# EAGLE design OB1_sensor_manufactured (EAGLE 9.7.0)

## Sheet 1 of 2: Sensors
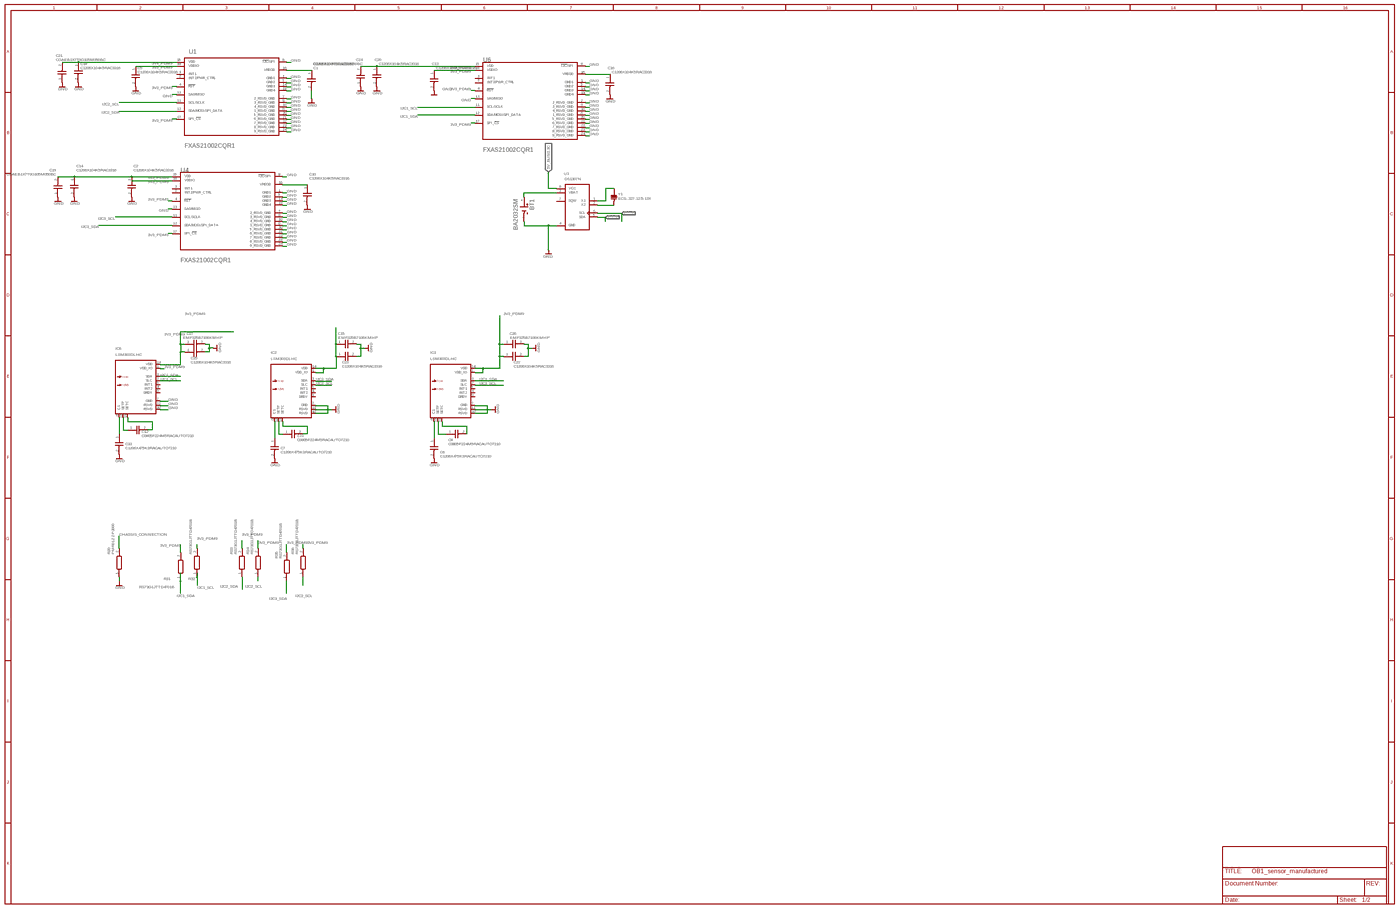
[diagram p0: schematic, sheet 1, overview]
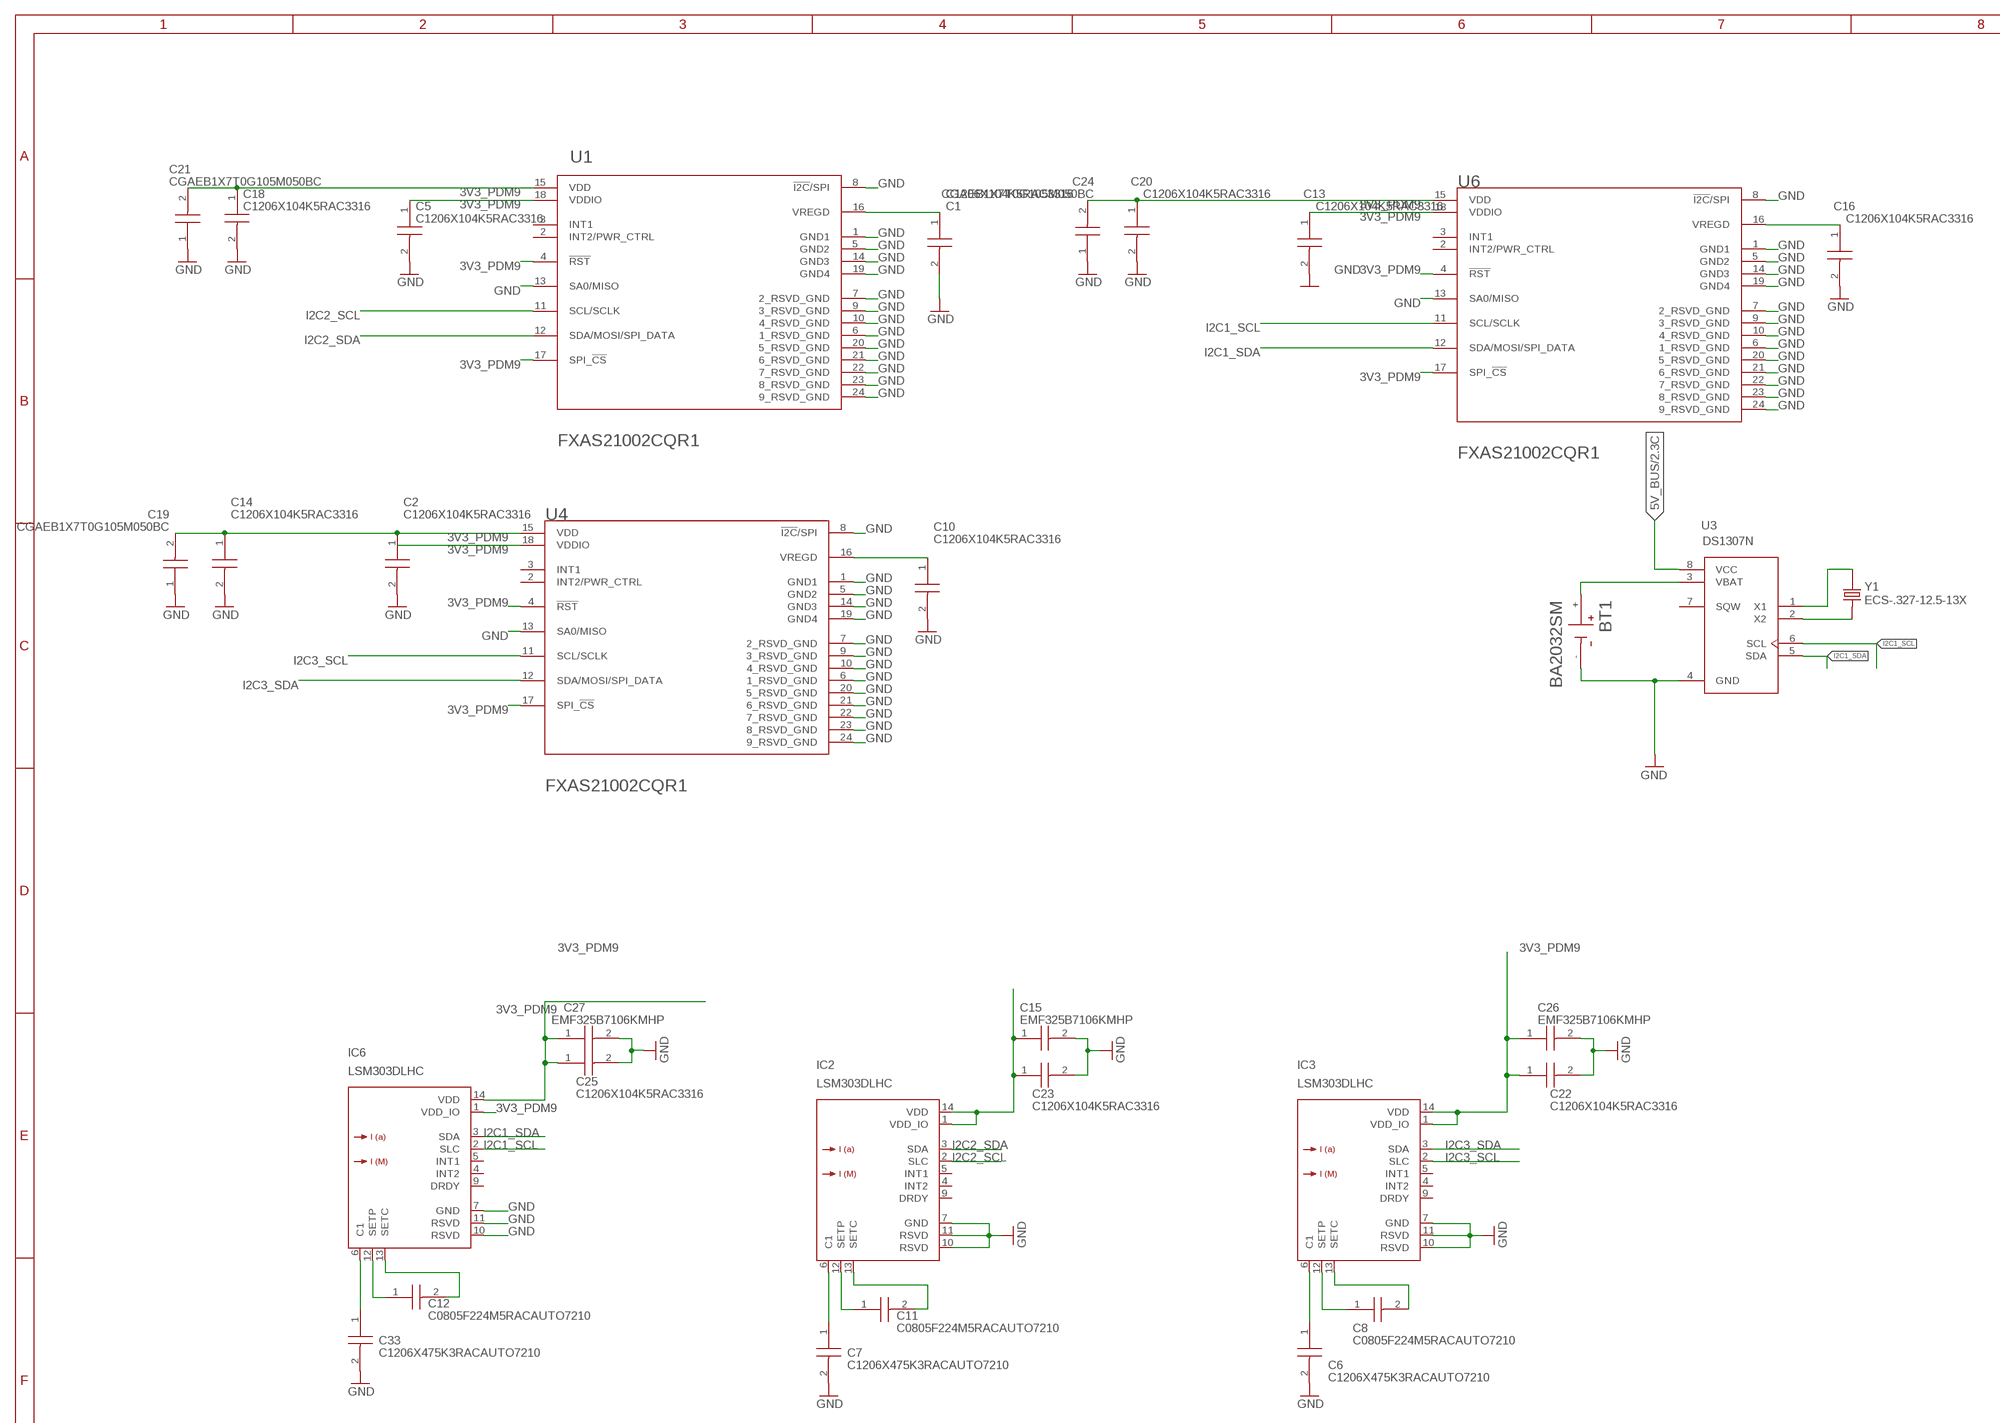
[diagram p1: schematic, sheet 1, part 1 of 4]
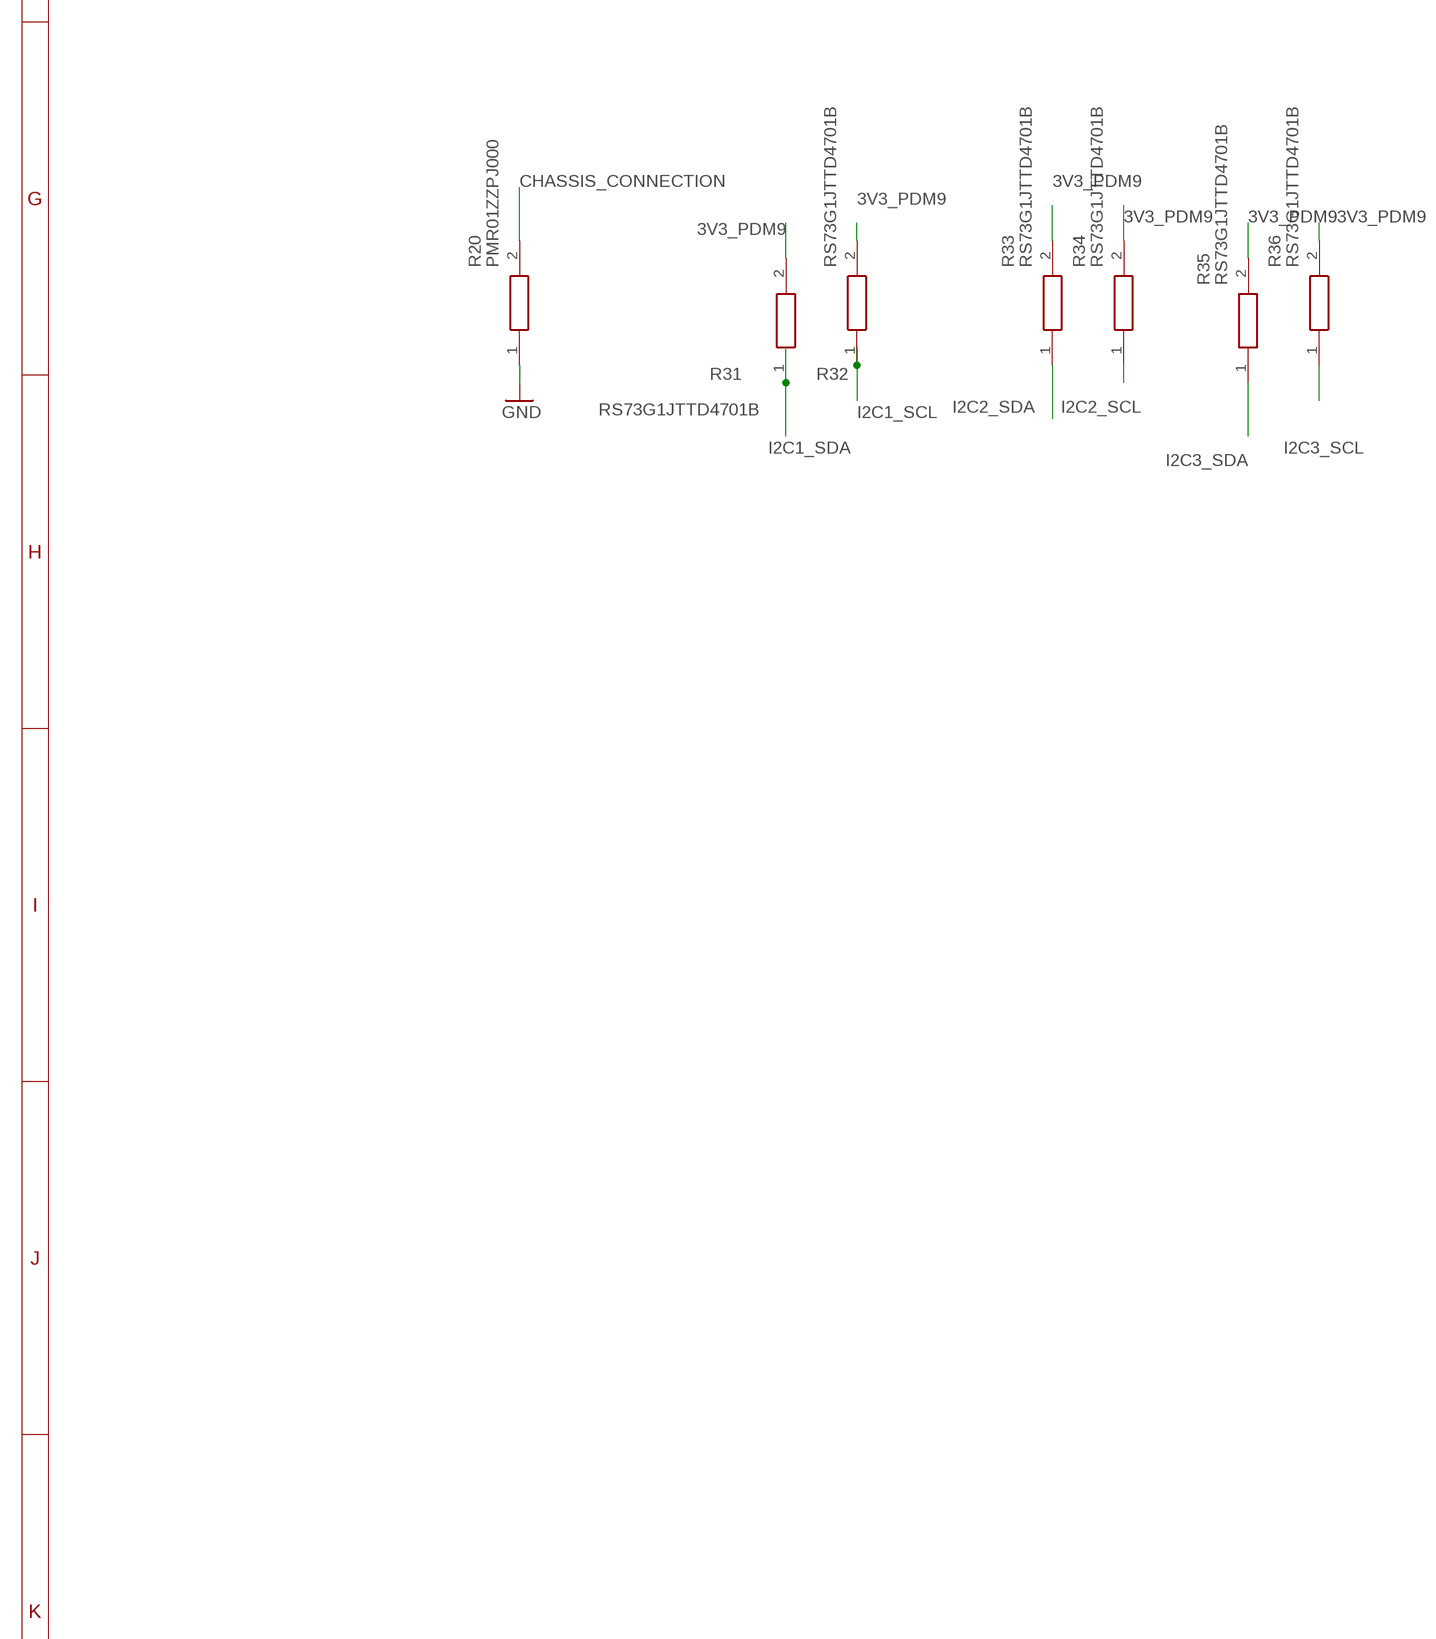
[diagram p2: schematic, sheet 1, part 2 of 4]
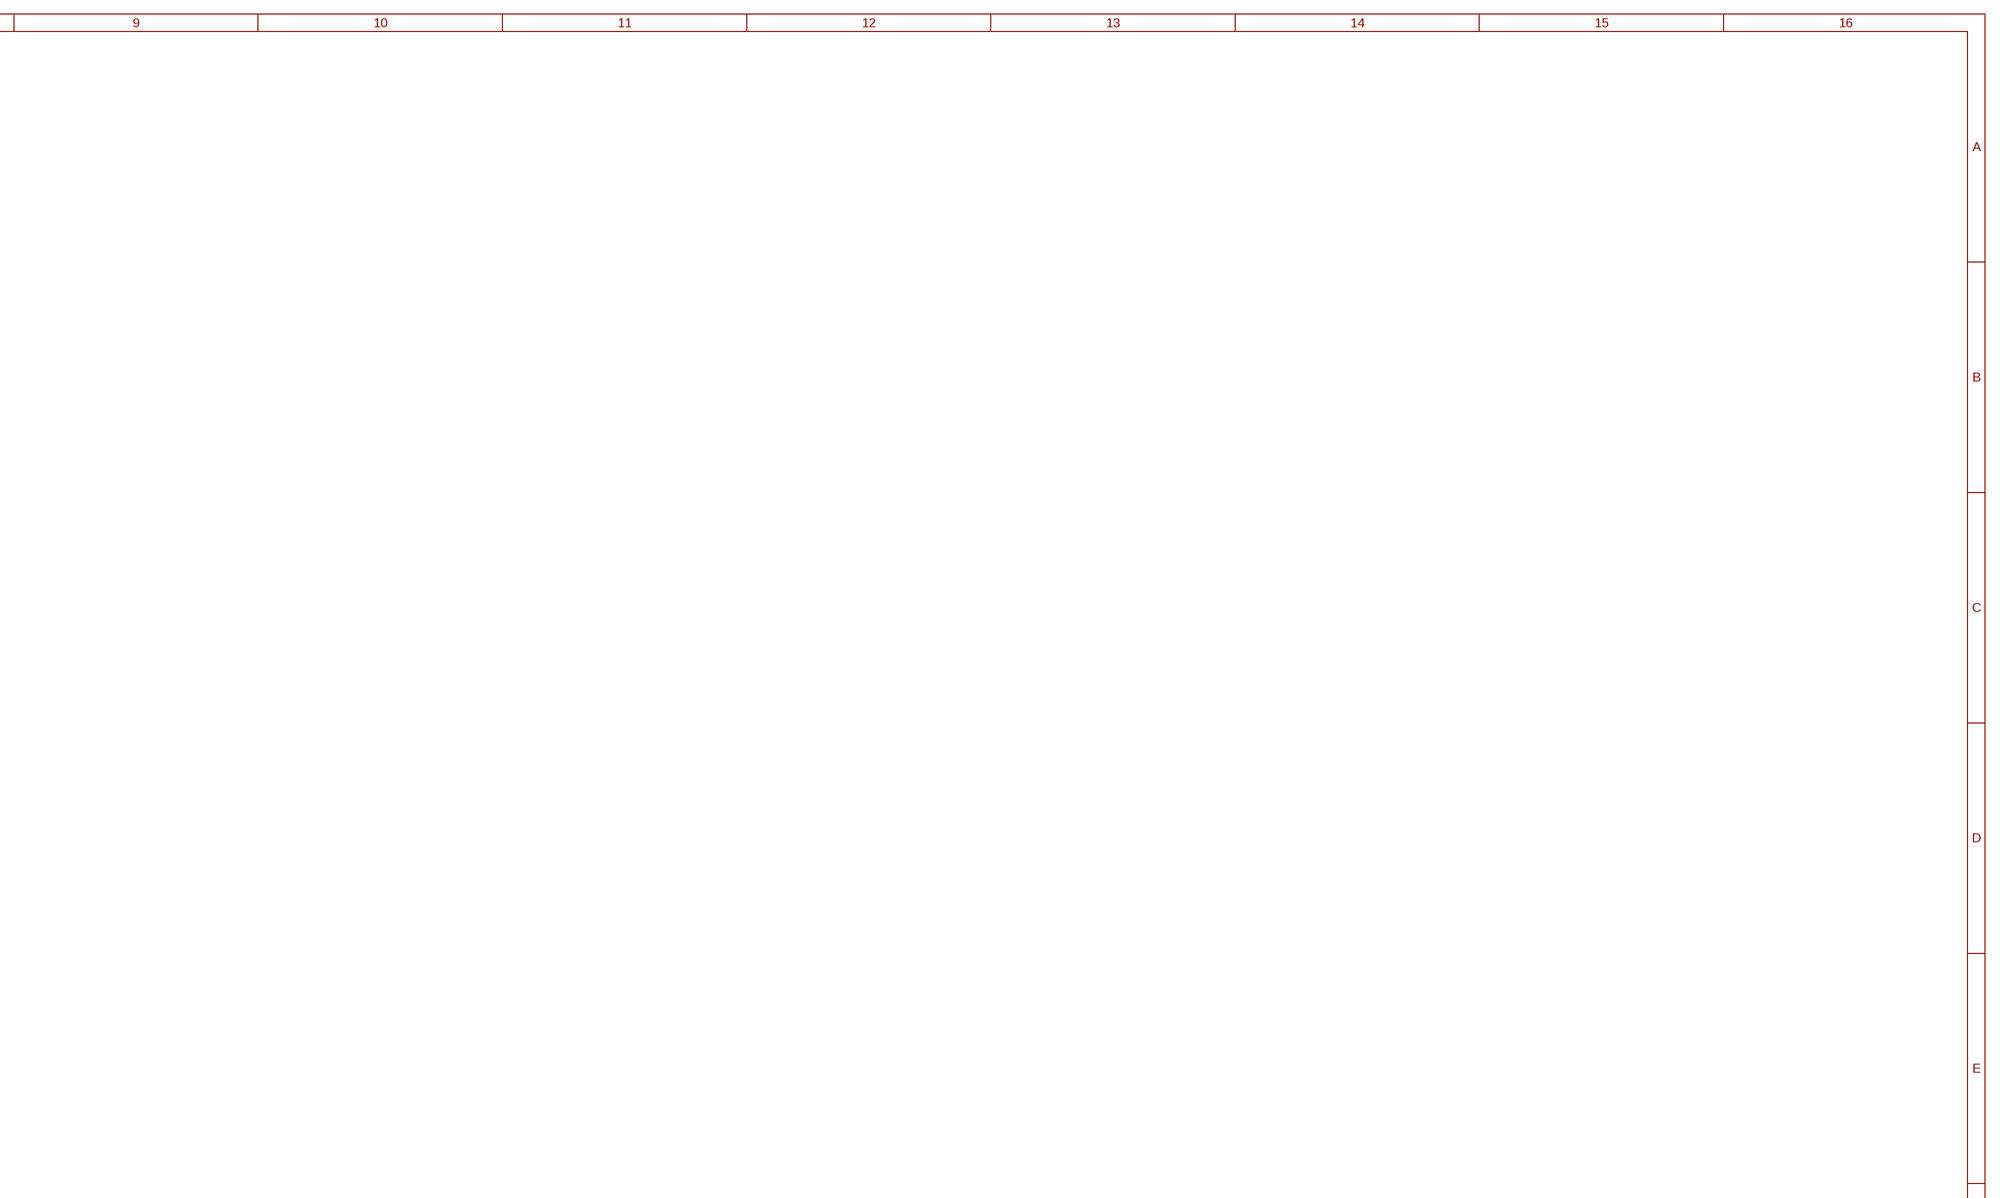
[diagram p3: schematic, sheet 1, part 3 of 4]
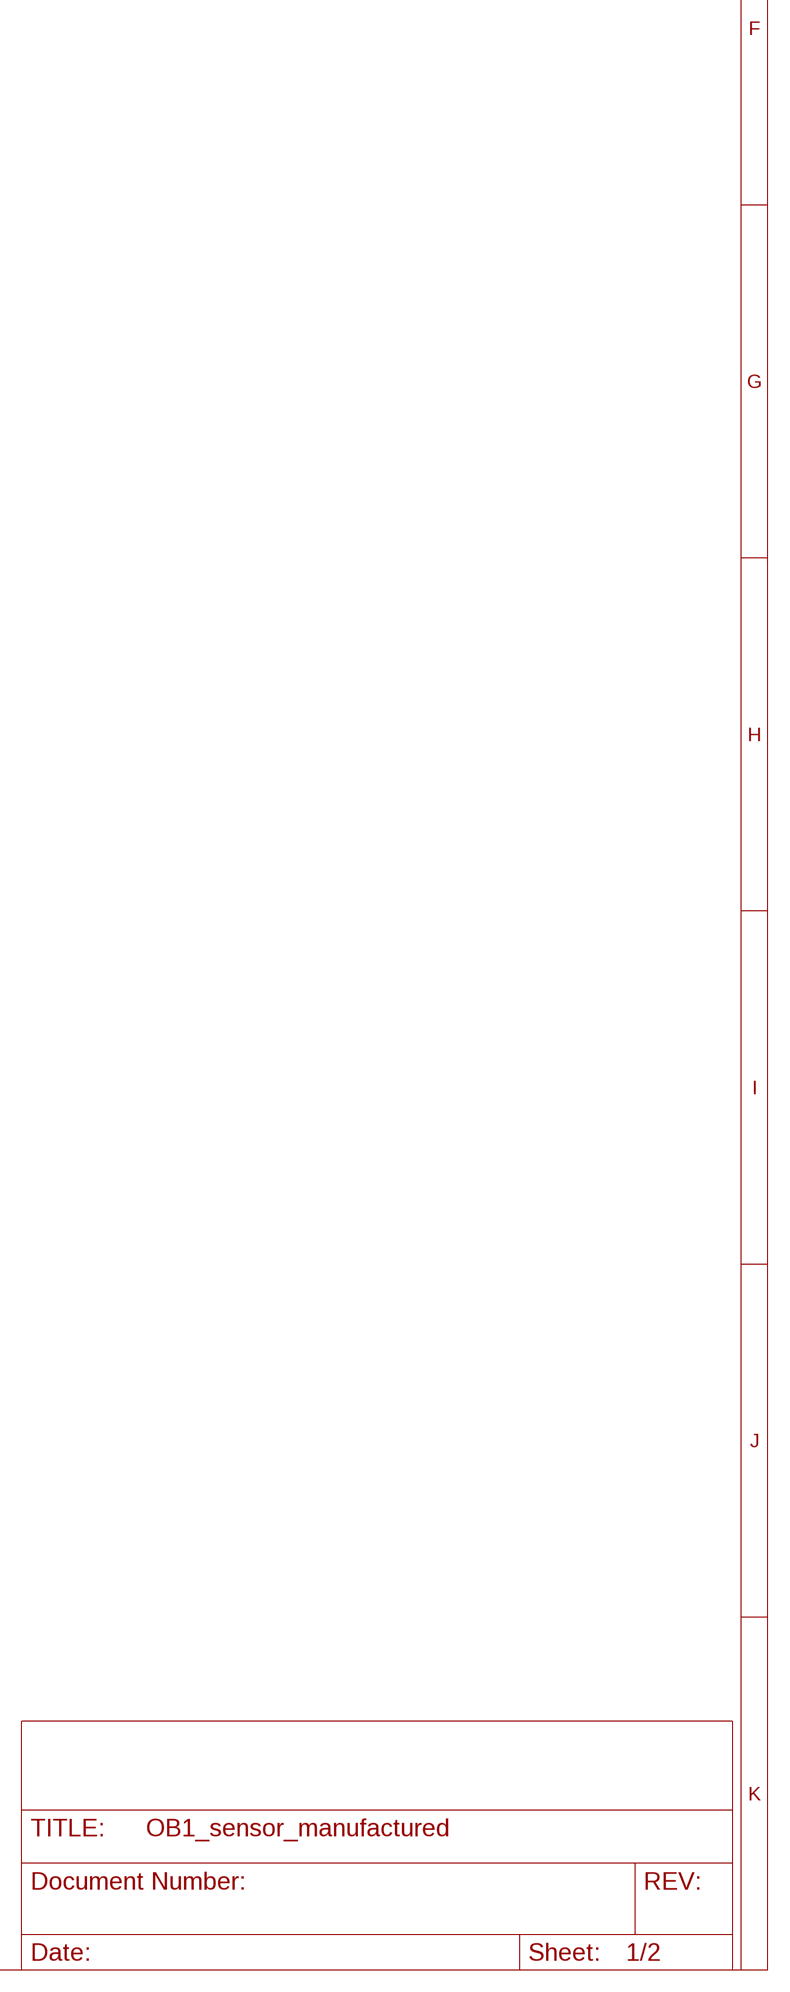
[diagram p4: schematic, sheet 1, part 4 of 4]

### Parts
BT1  BA2032SM  [BAT_BA2032SM]
C1  C1206X104K5RAC3316  [CAPC3316X98N]
C2  C1206X104K5RAC3316  [CAPC3316X98N]
C5  C1206X104K5RAC3316  [CAPC3316X98N]
C6  C1206X475K3RACAUTO7210  [CAPC3316X195N]
C7  C1206X475K3RACAUTO7210  [CAPC3316X195N]
C8  C0805F224M5RACAUTO7210  [CAPC2012X140N]
C10  C1206X104K5RAC3316  [CAPC3316X98N]
C11  C0805F224M5RACAUTO7210  [CAPC2012X140N]
C12  C0805F224M5RACAUTO7210  [CAPC2012X140N]
C13  C1206X104K5RAC3316  [CAPC3316X98N]
C14  C1206X104K5RAC3316  [CAPC3316X98N]
C15  EMF325B7106KMHP  [CAPC3225X270N]
C16  C1206X104K5RAC3316  [CAPC3316X98N]
C18  C1206X104K5RAC3316  [CAPC3316X98N]
C19  CGAEB1X7T0G105M050BC  [CAPC0611X68N]
C20  C1206X104K5RAC3316  [CAPC3316X98N]
C21  CGAEB1X7T0G105M050BC  [CAPC0611X68N]
C22  C1206X104K5RAC3316  [CAPC3316X98N]
C23  C1206X104K5RAC3316  [CAPC3316X98N]
C24  CGAEB1X7T0G105M050BC  [CAPC0611X68N]
C25  C1206X104K5RAC3316  [CAPC3316X98N]
C26  EMF325B7106KMHP  [CAPC3225X270N]
C27  EMF325B7106KMHP  [CAPC3225X270N]
C33  C1206X475K3RACAUTO7210  [CAPC3316X195N]
IC2  LSM303DLHC  [LGA-14]
IC3  LSM303DLHC  [LGA-14]
IC6  LSM303DLHC  [LGA-14]
R20  PMR01ZZPJ000  [RESC1005X35N]
R31  RS73G1JTTD4701B  [RESC1608X55N]
R32  RS73G1JTTD4701B  [RESC1608X55N]
R33  RS73G1JTTD4701B  [RESC1608X55N]
R34  RS73G1JTTD4701B  [RESC1608X55N]
R35  RS73G1JTTD4701B  [RESC1608X55N]
R36  RS73G1JTTD4701B  [RESC1608X55N]
U1  NXP_FXAS21002CQR1_EDITEDNXP_FXAS21002CQR1_0_0  [NXP_FXAS21002CQR1_0_EDITED]
U3  DS1307N  [DIP762W47P254L991H457Q8]
U4  NXP_FXAS21002CQR1_EDITEDNXP_FXAS21002CQR1_0_0  [NXP_FXAS21002CQR1_0_EDITED]
U6  NXP_FXAS21002CQR1_EDITEDNXP_FXAS21002CQR1_0_0  [NXP_FXAS21002CQR1_0_EDITED]
Y1  ECS-.327-12.5-13X  [XTAL_ECS-.327-12.5-13X]

### Nets
3V3_PDM9: C2.1 C5.1 C13.1 C14.1 C15.1 C18.1 C19.2 C20.1 C21.2 C22.1 C23.1 C24.2 C25.1 C26.1 C27.1 IC2.1(VDD_IO) IC2.14(VDD) IC3.1(VDD_IO) IC3.14(VDD) IC6.1(VDD_IO) IC6.14(VDD) R31.2 R32.2 R33.2 R34.2 R35.2 R36.2 U1.4(!RST!) U1.15(VDD) U1.17(SPI_!CS!) U1.18(VDDIO) U4.4(!RST!) U4.15(VDD) U4.17(SPI_!CS!) U4.18(VDDIO) U6.4(!RST!) U6.15(VDD) U6.17(SPI_!CS!) U6.18(VDDIO) ; also sheet 2
5V_BUS: U3.8(VCC) ; also sheet 2
CHASSIS_CONNECTION: R20.2
GND: BT1.- C1.2 C2.2 C5.2 C6.2 C7.2 C10.2 C13.2 C14.2 C15.2 C16.2 C18.2 C19.1 C20.2 C21.1 C22.2 C23.2 C24.1 C25.2 C26.2 C27.2 C33.2 IC2.7(GND) IC2.10(RSVD) IC2.11(RSVD) IC3.7(GND) IC3.10(RSVD) IC3.11(RSVD) IC6.7(GND) IC6.10(RSVD) IC6.11(RSVD) R20.1 U1.1(GND1) U1.5(GND2) U1.6(1_RSVD_GND) U1.7(2_RSVD_GND) U1.8(!I2C!/SPI) U1.9(3_RSVD_GND) U1.10(4_RSVD_GND) U1.13(SA0/MISO) U1.14(GND3) U1.19(GND4) U1.20(5_RSVD_GND) U1.21(6_RSVD_GND) U1.22(7_RSVD_GND) U1.23(8_RSVD_GND) U1.24(9_RSVD_GND) U3.4(GND) U4.1(GND1) U4.5(GND2) U4.6(1_RSVD_GND) U4.7(2_RSVD_GND) U4.8(!I2C!/SPI) U4.9(3_RSVD_GND) U4.10(4_RSVD_GND) U4.13(SA0/MISO) U4.14(GND3) U4.19(GND4) U4.20(5_RSVD_GND) U4.21(6_RSVD_GND) U4.22(7_RSVD_GND) U4.23(8_RSVD_GND) U4.24(9_RSVD_GND) U6.1(GND1) U6.5(GND2) U6.6(1_RSVD_GND) U6.7(2_RSVD_GND) U6.8(!I2C!/SPI) U6.9(3_RSVD_GND) U6.10(4_RSVD_GND) U6.13(SA0/MISO) U6.14(GND3) U6.19(GND4) U6.20(5_RSVD_GND) U6.21(6_RSVD_GND) U6.22(7_RSVD_GND) U6.23(8_RSVD_GND) U6.24(9_RSVD_GND) ; also sheet 2
I2C1_SCL: IC6.2(SLC) R32.1 U3.6(SCL) U6.11(SCL/SCLK) ; also sheet 2
I2C1_SDA: IC6.3(SDA) R31.1 U3.5(SDA) U6.12(SDA/MOSI/SPI_DATA) ; also sheet 2
I2C2_SCL: IC2.2(SLC) R34.1 U1.11(SCL/SCLK) ; also sheet 2
I2C2_SDA: IC2.3(SDA) R33.1 U1.12(SDA/MOSI/SPI_DATA) ; also sheet 2
I2C3_SCL: IC3.2(SLC) R36.1 U4.11(SCL/SCLK) ; also sheet 2
I2C3_SDA: IC3.3(SDA) R35.1 U4.12(SDA/MOSI/SPI_DATA) ; also sheet 2
N$8: C6.1 IC3.6(C1)
N$9: C8.1 IC3.12(SETP)
N$10: C8.2 IC3.13(SETC)
N$11: C11.1 IC2.12(SETP)
N$12: C11.2 IC2.13(SETC)
N$13: C7.1 IC2.6(C1)
N$14: C12.1 IC6.12(SETP)
N$15: C12.2 IC6.13(SETC)
N$16: C33.1 IC6.6(C1)
N$30: U3.2(X2) Y1.2
N$41: U3.1(X1) Y1.1
N$44: BT1.+ U3.3(VBAT)
N$67: C10.1 U4.16(VREGD)
N$71: C1.1 U1.16(VREGD)
N$72: C16.1 U6.16(VREGD)
Unconnected: IC2.4(INT2) IC2.5(INT1) IC2.9(DRDY) IC3.4(INT2) IC3.5(INT1) IC3.9(DRDY) IC6.4(INT2) IC6.5(INT1) IC6.9(DRDY) U1.2(INT2/PWR_CTRL) U1.3(INT1) U3.7(SQW) U4.2(INT2/PWR_CTRL) U4.3(INT1) U6.2(INT2/PWR_CTRL) U6.3(INT1)

## Sheet 2 of 2
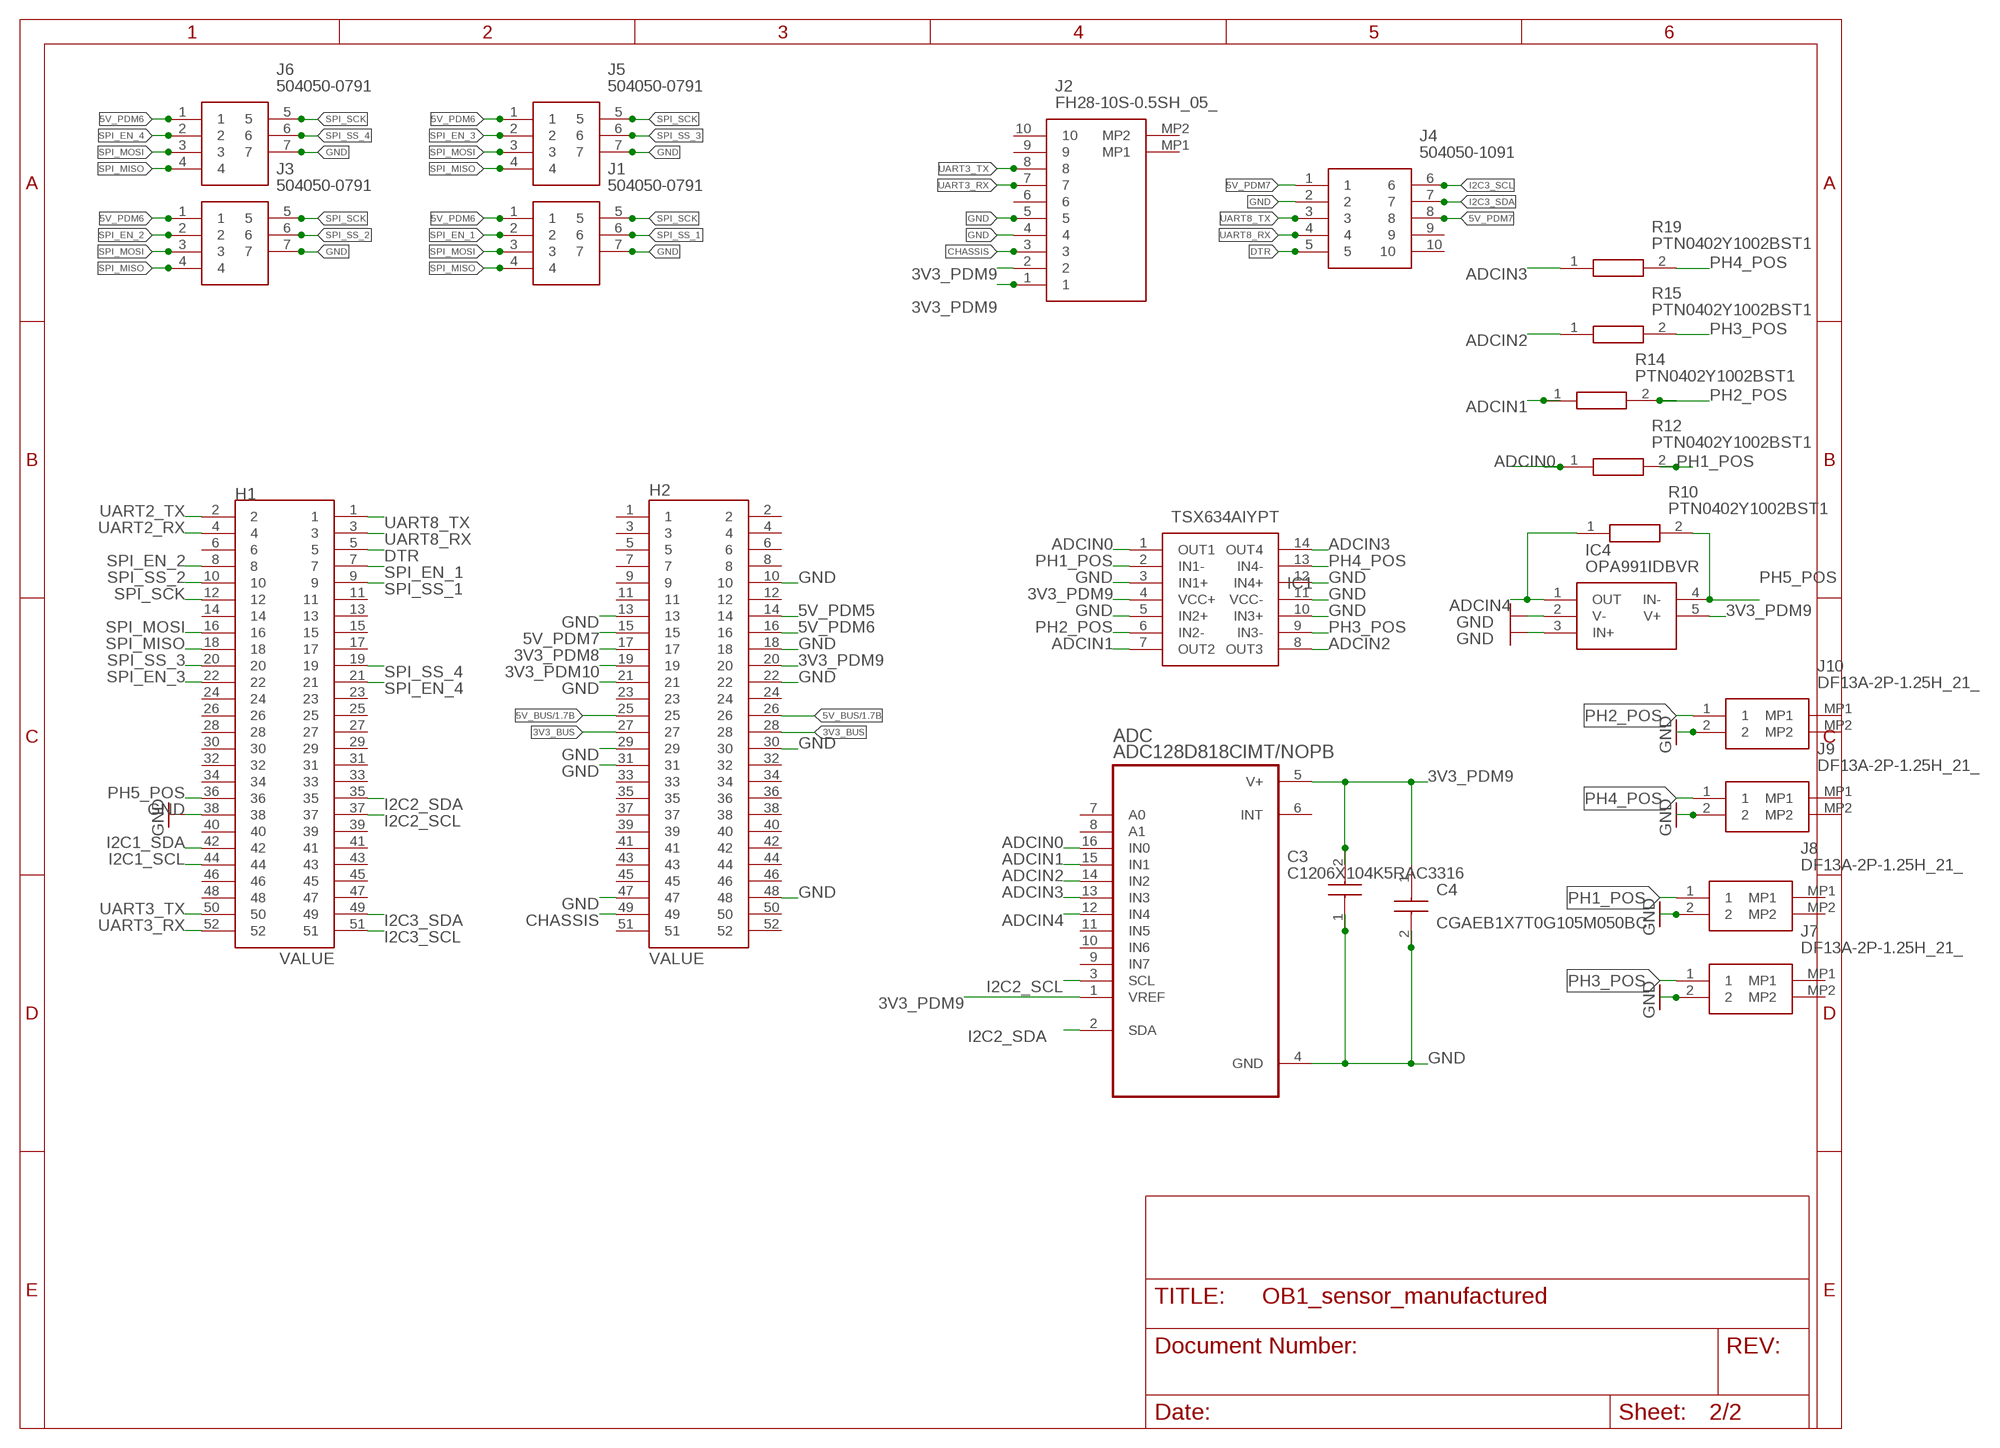
[diagram p5: schematic, sheet 2]

### Parts
ADC  ADC128D818CIMT/NOPB  [SOP65P640X120-16N]
C3  C1206X104K5RAC3316  [CAPC3316X98N]
C4  CGAEB1X7T0G105M050BC  [CAPC0611X68N]
H1  ESQ-126-39-G-D  [SAMTEC_ESQ-126-39-G-D]
H2  ESQ-126-39-G-D  [SAMTEC_ESQ-126-39-G-D]
IC1  TSX634AIYPT  [SOP65P640X120-14N]
IC4  OPA991IDBVR  [SOT95P280X145-5N]
J1  504050-0791  [504050-0791]
J2  FH28-10S-0.5SH_05_  [FH2810S05SH05]
J3  504050-0791  [504050-0791]
J4  504050-1091  [504050-1091]
J5  504050-0791  [504050-0791]
J6  504050-0791  [504050-0791]
J7  DF13A-2P-1.25H_21_  [DF13A2P125H21]
J8  DF13A-2P-1.25H_21_  [DF13A2P125H21]
J9  DF13A-2P-1.25H_21_  [DF13A2P125H21]
J10  DF13A-2P-1.25H_21_  [DF13A2P125H21]
R10  PTN0402Y1002BST1  [RESC1106X84N]
R12  PTN0402Y1002BST1  [RESC1106X84N]
R14  PTN0402Y1002BST1  [RESC1106X84N]
R15  PTN0402Y1002BST1  [RESC1106X84N]
R19  PTN0402Y1002BST1  [RESC1106X84N]

### Nets
3V3_BUS: H2.27 H2.28
3V3_PDM8: H2.17
3V3_PDM9: ADC.1(VREF) ADC.5(V+) C3.2 C4.1 H2.20 IC1.4(VCC+) IC4.5(V+) J2.1 J2.2 ; also sheet 1
3V3_PDM10: H2.19
5V_BUS: H2.25 H2.26 ; also sheet 1
5V_PDM5: H2.14
5V_PDM6: H2.16 J1.1 J3.1 J5.1 J6.1
5V_PDM7: H2.15 J4.1 J4.8
ADCIN0: ADC.16(IN0) IC1.1(OUT1) R12.1
ADCIN1: ADC.15(IN1) IC1.7(OUT2) R14.1
ADCIN2: ADC.14(IN2) IC1.8(OUT3) R15.1
ADCIN3: ADC.13(IN3) IC1.14(OUT4) R19.1
ADCIN4: ADC.12(IN4) IC4.1(OUT) R10.1
CHASSIS: H2.49 J2.3
DTR: H1.5 J4.5
GND: ADC.4(GND) C3.1 C4.2 H1.38 H2.10 H2.13 H2.18 H2.21 H2.22 H2.29 H2.30 H2.31 H2.47 H2.48 IC1.3(IN1+) IC1.5(IN2+) IC1.10(IN3+) IC1.11(VCC-) IC1.12(IN4+) IC4.2(V-) IC4.3(IN+) J1.7 J2.4 J2.5 J3.7 J4.2 J5.7 J6.7 J7.2 J8.2 J9.2 J10.2 ; also sheet 1
I2C1_SCL: H1.44 ; also sheet 1
I2C1_SDA: H1.42 ; also sheet 1
I2C2_SCL: ADC.3(SCL) H1.37 ; also sheet 1
I2C2_SDA: ADC.2(SDA) H1.35 ; also sheet 1
I2C3_SCL: H1.51 J4.6 ; also sheet 1
I2C3_SDA: H1.49 J4.7 ; also sheet 1
PH1_POS: IC1.2(IN1-) J8.1 R12.2
PH2_POS: IC1.6(IN2-) J10.1 R14.2
PH3_POS: IC1.9(IN3-) J7.1 R15.2
PH4_POS: IC1.13(IN4-) J9.1 R19.2
PH5_POS: H1.36 IC4.4(IN-) R10.2
SPI_EN_1: H1.7 J1.2
SPI_EN_2: H1.8 J3.2
SPI_EN_3: H1.22 J5.2
SPI_EN_4: H1.21 J6.2
SPI_MISO: H1.18 J1.4 J3.4 J5.4 J6.4
SPI_MOSI: H1.16 J1.3 J3.3 J5.3 J6.3
SPI_SCK: H1.12 J1.5 J3.5 J5.5 J6.5
SPI_SS_1: H1.9 J1.6
SPI_SS_2: H1.10 J3.6
SPI_SS_3: H1.20 J5.6
SPI_SS_4: H1.19 J6.6
UART2_RX: H1.4
UART2_TX: H1.2
UART3_RX: H1.52 J2.7
UART3_TX: H1.50 J2.8
UART8_RX: H1.3 J4.4
UART8_TX: H1.1 J4.3
Unconnected: ADC.6(INT) ADC.7(A0) ADC.8(A1) ADC.9(IN7) ADC.10(IN6) ADC.11(IN5) H1.6 H1.11 H1.13 H1.14 H1.15 H1.17 H1.23 H1.24 H1.25 H1.26 H1.27 H1.28 H1.29 H1.30 H1.31 H1.32 H1.33 H1.34 H1.39 H1.40 H1.41 H1.43 H1.45 H1.46 H1.47 H1.48 H2.1 H2.2 H2.3 H2.4 H2.5 H2.6 H2.7 H2.8 H2.9 H2.11 H2.12 H2.23 H2.24 H2.32 H2.33 H2.34 H2.35 H2.36 H2.37 H2.38 H2.39 H2.40 H2.41 H2.42 H2.43 H2.44 H2.45 H2.46 H2.50 H2.51 H2.52 J2.6 J2.9 J2.10 J2.MP1 J2.MP2 J4.9 J4.10 J7.MP1 J7.MP2 J8.MP1 J8.MP2 J9.MP1 J9.MP2 J10.MP1 J10.MP2

## Library data of the parts
ADC = ADC128D818CIMT_NOPB:ADC128D818CIMT/NOPB; DESCRIPTION: 12-Bit, 82SPS, 8-Ch Delta-Sigma ADC with Temp Sensor, INT / EXT Voltage Reference & I2C Interface 16-TSSOP -40 to 125; DIGI-KEY_PART_NUMBER: ADC128D818CIMT/NOPB-ND; MF: Texas Instruments; MP: ADC128D818CIMT/NOPB; PACKAGE: TSSOP-16 Texas Instruments; PURCHASE-URL: https://pricing.snapeda.com/search/part/ADC128D818CIMT/NOPB/?ref=eda
BT1 = BA2032SM_PAD_replace:BA2032SM: BATTERY HOLDER COIN 20MM SMD; DESCRIPTION: BATTERY HOLDER COIN 20MM SMD; DIGI-KEY_PART_NUMBER: BA2032SM-ND; MF: MPD; MP: BA2032SM; PACKAGE: FakePackage u; PURCHASE-URL: https://pricing.snapeda.com/search/part/BA2032SM/?ref=eda
C1-C3 C5 C10 C13 C14 C16 C18 C20 C22 C23 C25 = SamacSys_Parts:C1206X104K5RAC3316: Multilayer Ceramic Capacitors MLCC - SMD/SMT 50V 0.1uF X7R AUTO 5mm Flex VW 80808 Source: Datasheet <https://componentsearchengine.com/Datasheets/2/C1206X104K5RAC3316.pdf>; DESCRIPTION: Multilayer Ceramic Capacitors MLCC - SMD/SMT 50V 0.1uF X7R AUTO 5mm Flex VW 80808; HEIGHT: 0.98mm; MANUFACTURER_NAME: Kemet; MANUFACTURER_PART_NUMBER: C1206X104K5RAC3316; MOUSER_PART_NUMBER: 80-C1206X104K5RC3316; MOUSER_PRICE-STOCK: https://www.mouser.co.uk/ProductDetail/KEMET/C1206X104K5RAC3316?qs=PzGy0jfpSMtwBv5U2rNx3w%3D%3D
C4 C19 C21 C24 = SamacSys_Parts:CGAEB1X7T0G105M050BC: Multilayer Ceramic Capacitors MLCC - SMD/SMT 0204 4VDC 1uF 20% X7T AEC-Q200 Source: Datasheet <https://media.digikey.com/pdf/Data Sheets/TDK PDFs/CGAEB1X7T0G105M050BC.pdf>; DESCRIPTION: Multilayer Ceramic Capacitors MLCC - SMD/SMT 0204 4VDC 1uF 20% X7T AEC-Q200; HEIGHT: 0.68mm; MANUFACTURER_NAME: TDK; MANUFACTURER_PART_NUMBER: CGAEB1X7T0G105M050BC; MOUSER_PART_NUMBER: 810-CGAEB1X7T0G105M5; MOUSER_PRICE-STOCK: https://www.mouser.co.uk/ProductDetail/TDK/CGAEB1X7T0G105M050BC?qs=xZ%2FP%252Ba9zWqZdS0ZPItYEjQ%3D%3D
C6 C7 C33 = SamacSys_Parts:C1206X475K3RACAUTO7210: Multilayer Ceramic Capacitors MLCC - SMD/SMT 25V 4.7uF X7R AUTO 10% Flex AECQ200 Source: Datasheet; DESCRIPTION: Multilayer Ceramic Capacitors MLCC - SMD/SMT 25V 4.7uF X7R AUTO 10% Flex AECQ200; HEIGHT: 1.95mm; MANUFACTURER_NAME: Kemet; MANUFACTURER_PART_NUMBER: C1206X475K3RACAUTO7210; MOUSER_PART_NUMBER: 80-C1206X475K3RAUTLR; MOUSER_PRICE-STOCK: https://www.mouser.co.uk/ProductDetail/KEMET/C1206X475K3RACAUTO7210/?qs=ds50AKTGxA8JAgT9kv9azQ%3D%3D
C8 C11 C12 = SamacSys_Parts:C0805F224M5RACAUTO7210: Multilayer Ceramic Capacitors MLCC - SMD/SMT 50V 0.22uF X7R AUTO 10% Open Mode Source: Datasheet <https://www.mouser.pe/datasheet/2/212/KEM_C1012_X7R_OPENMODE_SMD-1103265.pdf>; DESCRIPTION: Multilayer Ceramic Capacitors MLCC - SMD/SMT 50V 0.22uF X7R AUTO 10% Open Mode; HEIGHT: 1.4mm; MANUFACTURER_NAME: Kemet; MANUFACTURER_PART_NUMBER: C0805F224M5RACAUTO7210; MOUSER_PART_NUMBER: 80-C0805F224M5RAUTLR; MOUSER_PRICE-STOCK: https://www.mouser.co.uk/ProductDetail/KEMET/C0805F224M5RACAUTO7210?qs=ds50AKTGxA%2Fj3Mx4owT2QA%3D%3D
C15 C26 C27 = SamacSys_Parts:EMF325B7106KMHP: Multilayer Ceramic Capacitors MLCC - SMD/SMT 1210 16VDC 10uF 10% AEC-Q200 Source: Datasheet <https://www.mouser.co.uk/datasheet/2/396/taiyo_yuden_12132018_mlcc11_hq_e-1510082.pdf>; DESCRIPTION: Multilayer Ceramic Capacitors MLCC - SMD/SMT 1210 16VDC 10uF 10% AEC-Q200; HEIGHT: 2.7mm; MANUFACTURER_NAME: TAIYO YUDEN; MANUFACTURER_PART_NUMBER: EMF325B7106KMHP; MOUSER_PART_NUMBER: 963-EMF325B7106KMHP; MOUSER_PRICE-STOCK: https://www.mouser.co.uk/ProductDetail/Taiyo-Yuden/EMF325B7106KMHP?qs=W%2FMpXkg%252BdQ6RYRzYwpaQvA%3D%3D
H1 H2 = ESQ-126-39-G-D:ESQ-126-39-G-D: Conn Elevated Socket SKT 52 POS 2.54mm Solder ST Thru-Hole Tube; DESCRIPTION: 52 Position Elevated Socket Connector Through Hole; DIGI-KEY_PART_NUMBER: SAM10462-ND; DIGI-KEY_PURCHASE_URL: https://www.digikey.com/product-detail/en/samtec-inc/ESQ-126-39-G-D/SAM10462-ND/3601055?utm_source=snapeda&utm_medium=aggregator&utm_campaign=symbol; MF: Samtec; MP: ESQ-126-39-G-D; PACKAGE: None
IC1 = SamacSys_Parts:TSX634AIYPT: Operational Amplifiers - Op Amps CONDITIONING & INTERFACES Source: Datasheet <https://componentsearchengine.com/Datasheets/1/TSX634AIYPT.pdf>; DESCRIPTION: Operational Amplifiers - Op Amps CONDITIONING & INTERFACES; HEIGHT: 1.2mm; MANUFACTURER_NAME: STMicroelectronics; MANUFACTURER_PART_NUMBER: TSX634AIYPT; MOUSER_PART_NUMBER: 511-TSX634AIYPT; MOUSER_PRICE-STOCK: https://www.mouser.com/Search/Refine.aspx?Keyword=511-TSX634AIYPT
IC2 IC3 IC6 = st-microelectronics:LSM303DLHC: Ultra compact high performance e-compass, 3D accelerometer and 3D magnetometer module Source: DM00027543-118326.pdf
IC4 = SamacSys_Parts:OPA991IDBVR: Operational Amplifiers - Op Amps 40-V, single 4.5MHz, rail-to-rail input/output, low-offset-voltage, low-noise op amp 5-SOT-23 -40 to 125 Source: Datasheet <https://www.digikey.com/en/products/detail/texas-instruments/OPA991IDBVR/13174045>; DESCRIPTION: Operational Amplifiers - Op Amps 40-V, single 4.5MHz, rail-to-rail input/output, low-offset-voltage, low-noise op amp 5-SOT-23 -40 to 125; HEIGHT: 1.45mm; MANUFACTURER_NAME: Texas Instruments; MANUFACTURER_PART_NUMBER: OPA991IDBVR; MOUSER_PART_NUMBER: 595-OPA991IDBVR; MOUSER_PRICE-STOCK: https://www.mouser.co.uk/ProductDetail/Texas-Instruments/OPA991IDBVR?qs=yqaQSyyJnNhefvxPlnAwIw%3D%3D
J1 J3 J5 J6 = 504050-0791:504050-0791: Molex 504050 Series, 1.5mm Pitch 7 Way 1 Row Right Angle PCB Header, SMT Termination, 3A Source: Datasheet <https://componentsearchengine.com/Datasheets/1/504050-0791.pdf>; DESCRIPTION: Molex 504050 Series, 1.5mm Pitch 7 Way 1 Row Right Angle PCB Header, SMT Termination, 3A; HEIGHT: mm; MANUFACTURER_NAME: Molex; MANUFACTURER_PART_NUMBER: 504050-0791; MOUSER_PART_NUMBER: 538-504050-0791; MOUSER_PRICE-STOCK: https://www.mouser.com/Search/Refine.aspx?Keyword=538-504050-0791
J2 = FH28-10S-0.5SH_05_:FH28-10S-0.5SH_05_: Hirose FH28 Series 0.5mm Pitch 10 Way 1 Row Right Angle SMT Female FPC Connector with Y, Gold Plated Contacts Source: Datasheet <https://componentsearchengine.com/Datasheets/1/FH28-10S-0.5SH(05).pdf>; DESCRIPTION: Hirose FH28 Series 0.5mm Pitch 10 Way 1 Row Right Angle SMT Female FPC Connector with Y, Gold Plated Contacts; HEIGHT: 5.4mm; MANUFACTURER_NAME: Hirose; MANUFACTURER_PART_NUMBER: FH28-10S-0.5SH(05); MOUSER_PART_NUMBER: 798-FH2810S05SH05; MOUSER_PRICE-STOCK: https://www.mouser.com/Search/Refine.aspx?Keyword=798-FH2810S05SH05
J4 = 504050-1091:504050-1091: Pico-Lock SMT Wire-to-Board Header 10way Molex 504050 Series, 1.5mm Pitch 10 Way 1 Row Right Angle PCB Header, SMT Termination, 3A Source: Datasheet <https://componentsearchengine.com/Datasheets/1/504050-1091.pdf>; DESCRIPTION: Pico-Lock SMT Wire-to-Board Header 10way Molex 504050 Series, 1.5mm Pitch 10 Way 1 Row Right Angle PCB Header, SMT Termination, 3A; HEIGHT: mm; MANUFACTURER_NAME: Molex; MANUFACTURER_PART_NUMBER: 504050-1091; MOUSER_PART_NUMBER: 538-504050-1091; MOUSER_PRICE-STOCK: https://www.mouser.com/Search/Refine.aspx?Keyword=538-504050-1091
J7-J10 = SamacSys_Parts:DF13A-2P-1.25H_21_: Headers & Wire Housings 2P SNG ROW PIN HDR R/A SMT Source: Datasheet <https://componentsearchengine.com/Datasheets/1/DF13A-2P-1.25H(21).pdf>; DESCRIPTION: Headers & Wire Housings 2P SNG ROW PIN HDR R/A SMT; HEIGHT: 3.75mm; MANUFACTURER_NAME: Hirose; MANUFACTURER_PART_NUMBER: DF13A-2P-1.25H(21); MOUSER_PART_NUMBER: 798-DF13A2P125H21; MOUSER_PRICE-STOCK: https://www.mouser.co.uk/ProductDetail/Hirose-Connector/DF13A-2P-125H21?qs=XQjbzJWzFPVnh5jyZGKQ3w%3D%3D
R10 R12 R14 R15 R19 = SamacSys_Parts:PTN0402Y1002BST1: VISHAY - PTN0402Y1002BST1 - SMD Chip Resistor, 10 kohm, +/- 0.1%, 50 mW, 0402 [1005 Metric], Thin Film Source: Datasheet; DESCRIPTION: VISHAY - PTN0402Y1002BST1 - SMD Chip Resistor, 10 kohm, +/- 0.1%, 50 mW, 0402 [1005 Metric], Thin Film; HEIGHT: 0.838mm; MANUFACTURER_NAME: Vishay; MANUFACTURER_PART_NUMBER: PTN0402Y1002BST1; MOUSER_PART_NUMBER: 71-PTN0402Y1002BST1; MOUSER_PRICE-STOCK: https://www.mouser.co.uk/ProductDetail/Vishay-Thin-Film/PTN0402Y1002BST1?qs=zW32dvEIR3tBRhnCphHWiQ%3D%3D
R20 = SamacSys_Parts:PMR01ZZPJ000: Current Sense Resistors - SMD 0402 0ohm Jumper 5% CS Metal Strip Source: Datasheet <https://www.rohm.com/datasheet/PMR01ZZPJ000/pmr-jpw-e>; DESCRIPTION: Current Sense Resistors - SMD 0402 0ohm Jumper 5% CS Metal Strip; HEIGHT: 0.35mm; MANUFACTURER_NAME: ROHM Semiconductor; MANUFACTURER_PART_NUMBER: PMR01ZZPJ000; MOUSER_PART_NUMBER: 755-PMR01ZZPJ000; MOUSER_PRICE-STOCK: https://www.mouser.com/Search/Refine.aspx?Keyword=755-PMR01ZZPJ000
R31-R36 = SamacSys_Parts:RS73G1JTTD4701B: Res Thick Film 0603 4.7K Ohm 0.1% 0.2W(1/5W) +/-50ppm/C Pad SMD Automotive T/R Source: Datasheet <https://www.arrow.com/en/products/rs73g1jttd4701b/koa-speer-electronics>; DESCRIPTION: Res Thick Film 0603 4.7K Ohm 0.1% 0.2W(1/5W) +/-50ppm/C Pad SMD Automotive T/R; HEIGHT: 0.55mm; MANUFACTURER_NAME: KOA Speer; MANUFACTURER_PART_NUMBER: RS73G1JTTD4701B; MOUSER_PART_NUMBER: 660-RS73G1JTTD4701B; MOUSER_PRICE-STOCK: https://www.mouser.co.uk/ProductDetail/KOA-Speer/RS73G1JTTD4701B?qs=GBLSl2AkirvCpoIql43rwg%3D%3D
U1 U4 U6 = NXP - FXAS21002CQR1:NXP_FXAS21002CQR1_EDITED: Gyroscope Triple 3.6V 24-Pin QFN T/R; CENTROID_NOT_SPECIFIED: No; DATASHEET: https://www.nxp.com/docs/en/data-sheet/FXAS21002.pdf; DEVICE_CLASS_L1: Sensors; DEVICE_CLASS_L2: Motion Sensors; DEVICE_CLASS_L3: Gyroscopes; DIGIKEY_DESCRIPTION: IC GYROSCOPE 3-AXIS 24QFN; DIGIKEY_PART_NUMBER: FXAS21002CQR1CT-ND; FOOTPRINT_URL: https://www.nxp.com/docs/en/package-information/98ASA00356D.pdf; HEIGHT: 1.1mm; LEAD_FREE: yes; MAX_SUPPLY_VOLTAGE: 3.6V; MF: NXP; MFG_PACKAGE_IDENT: SOT1681-1; MFG_PACKAGE_IDENT_DATE: 01/2016; MFG_PACKAGE_IDENT_REV: A; MIN_SUPPLY_VOLTAGE: 1.95V; MOUSER_DESCRIPTION: Gyroscopes Triple Axis }2000?/s 24-Pin QFN Tape and Reel; MOUSER_PART_NUMBER: 841-FXAS21002CQR1; MPN: FXAS21002CQR1; OPERATING_SUPPLY_CURRENT: 2.7mA; PACKAGE: VQFN24; PREFIX: U; ROHS: yes; SENSOR_OUTPUT: I2C,SPI; TEMPERATURE_RANGE_HIGH: +85°C; TEMPERATURE_RANGE_LOW: -40°C; VERIFICATION_VERSION: 0.0.0.1
U3 = DS1307N:DS1307N: Real Time Clock Serial 56Byte 8-Pin PDIP N; DESCRIPTION: Real Time Clock _RTC_ IC Clock/Calendar 56B I²C, 2-Wire Serial 8-DIP _0.300, 7.62mm_; DIGI-KEY_PART_NUMBER: DS1307N+-ND; DIGI-KEY_PURCHASE_URL: https://www.digikey.com/product-detail/en/maxim-integrated/DS1307N-/DS1307N--ND/1196883?utm_source=snapeda&utm_medium=aggregator&utm_campaign=symbol; MF: Maxim Integrated; MP: DS1307N+; PACKAGE: PDIP-8 Maxim
Y1 = ECS-.327-12.5-13X:ECS-.327-12.5-13X: Crystal Cylindrical Can, Radial; DESCRIPTION: 32.768kHz ±20ppm Crystal 12.5pF 35 kOhms Cylindrical Can, Radial; DIGI-KEY_PART_NUMBER: X1124-ND; DIGI-KEY_PURCHASE_URL: https://www.digikey.com/product-detail/en/ecs-inc/ECS-.327-12.5-13X/X1124-ND/827615?utm_source=snapeda&utm_medium=aggregator&utm_campaign=symbol; MF: ECS Inc.; MP: ECS-.327-12.5-13X; PACKAGE: Cylindrical Can Radial ECS International

## Board
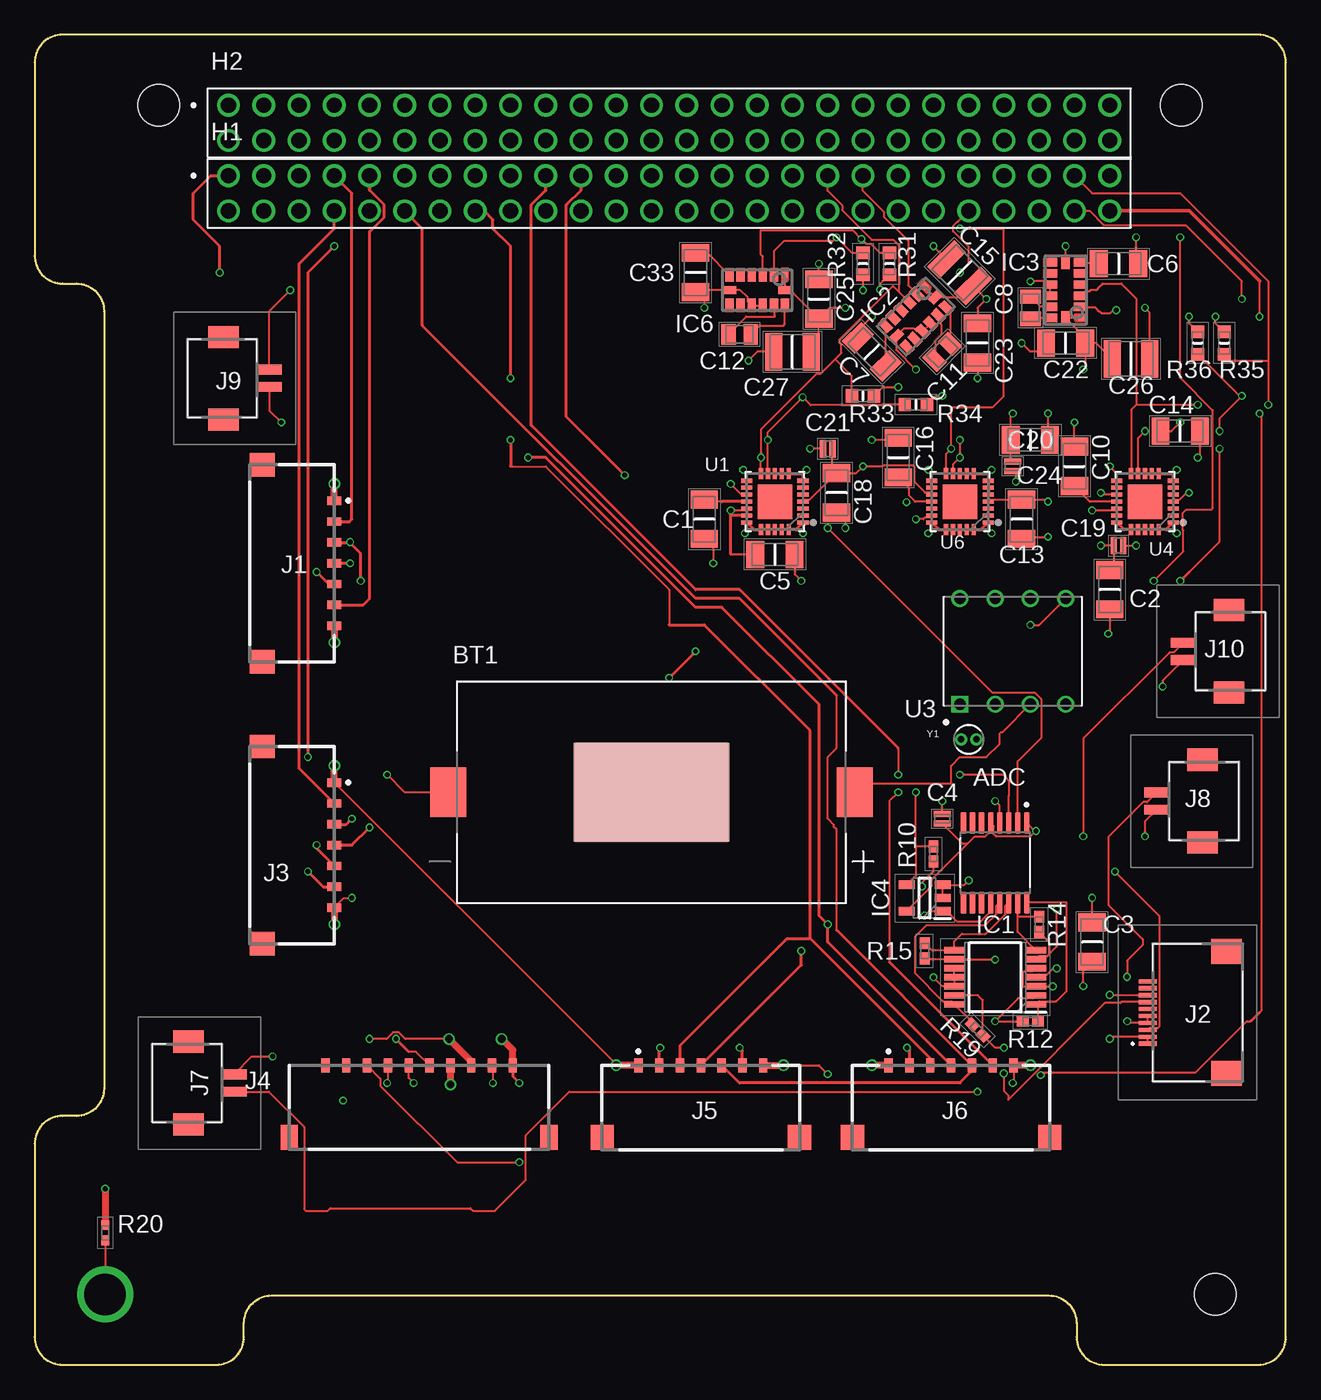
[diagram p6: board, top side]
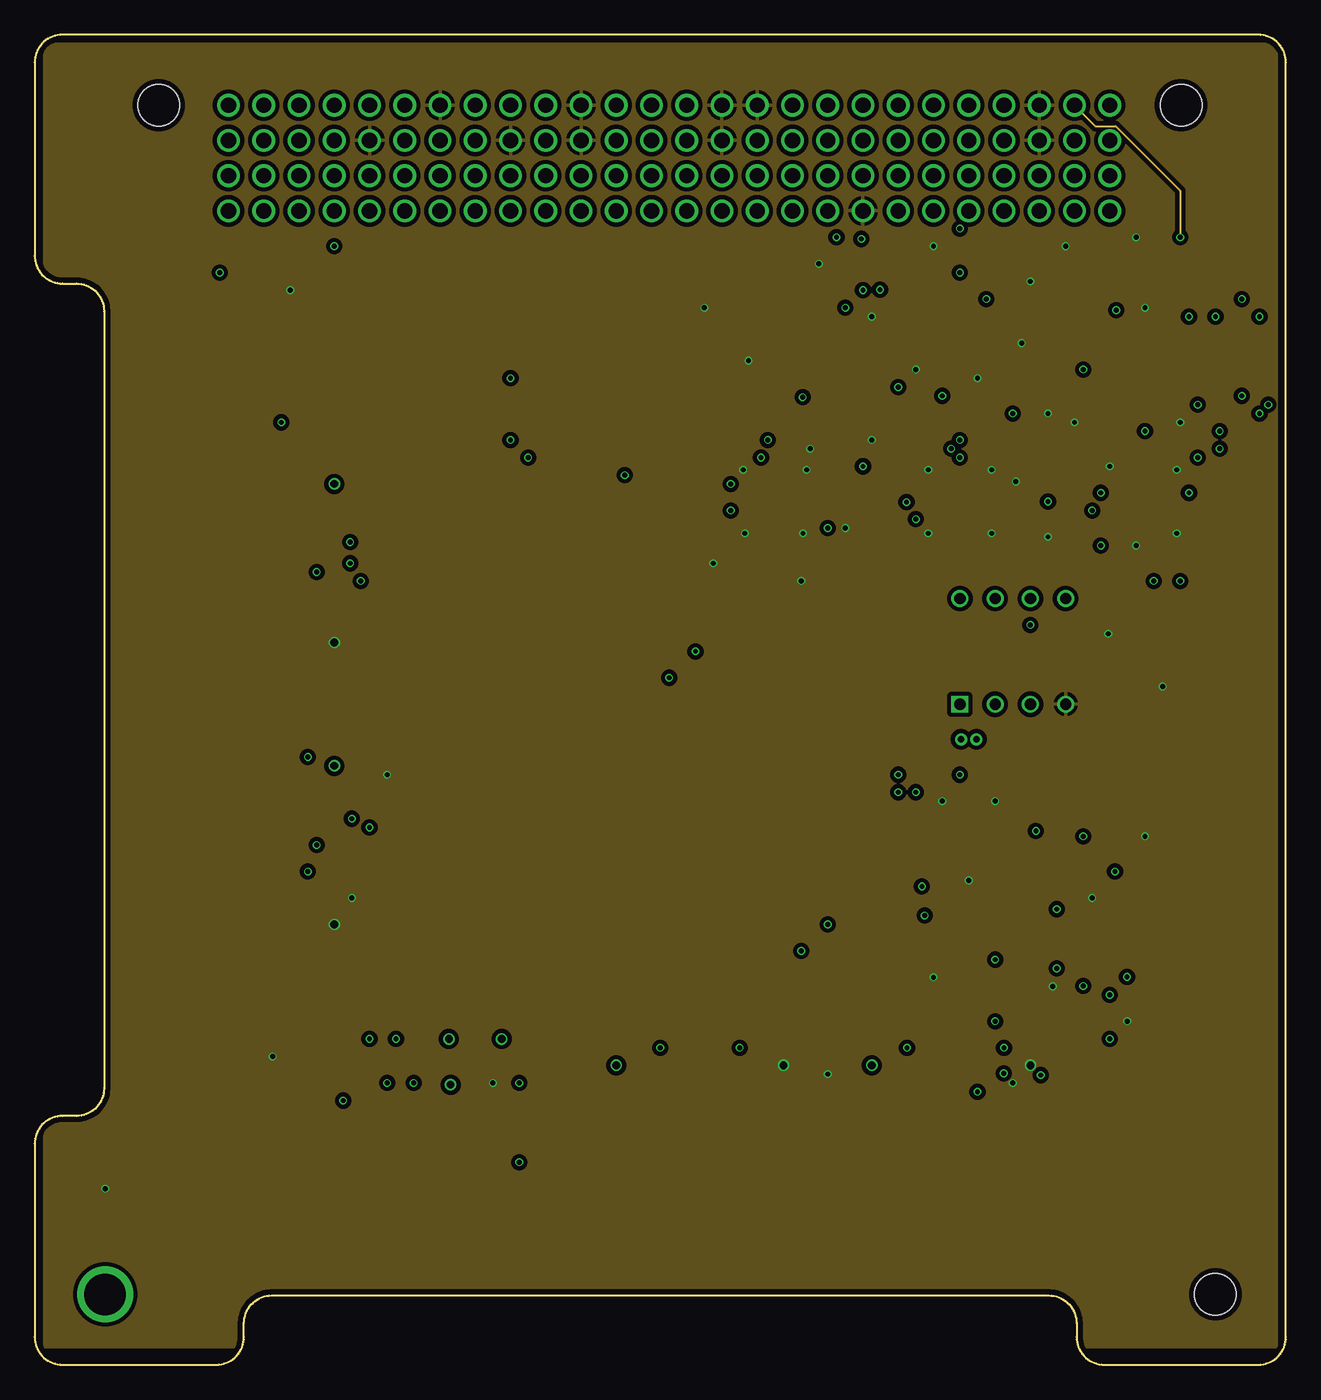
[diagram p7: board, inner layer Route2]
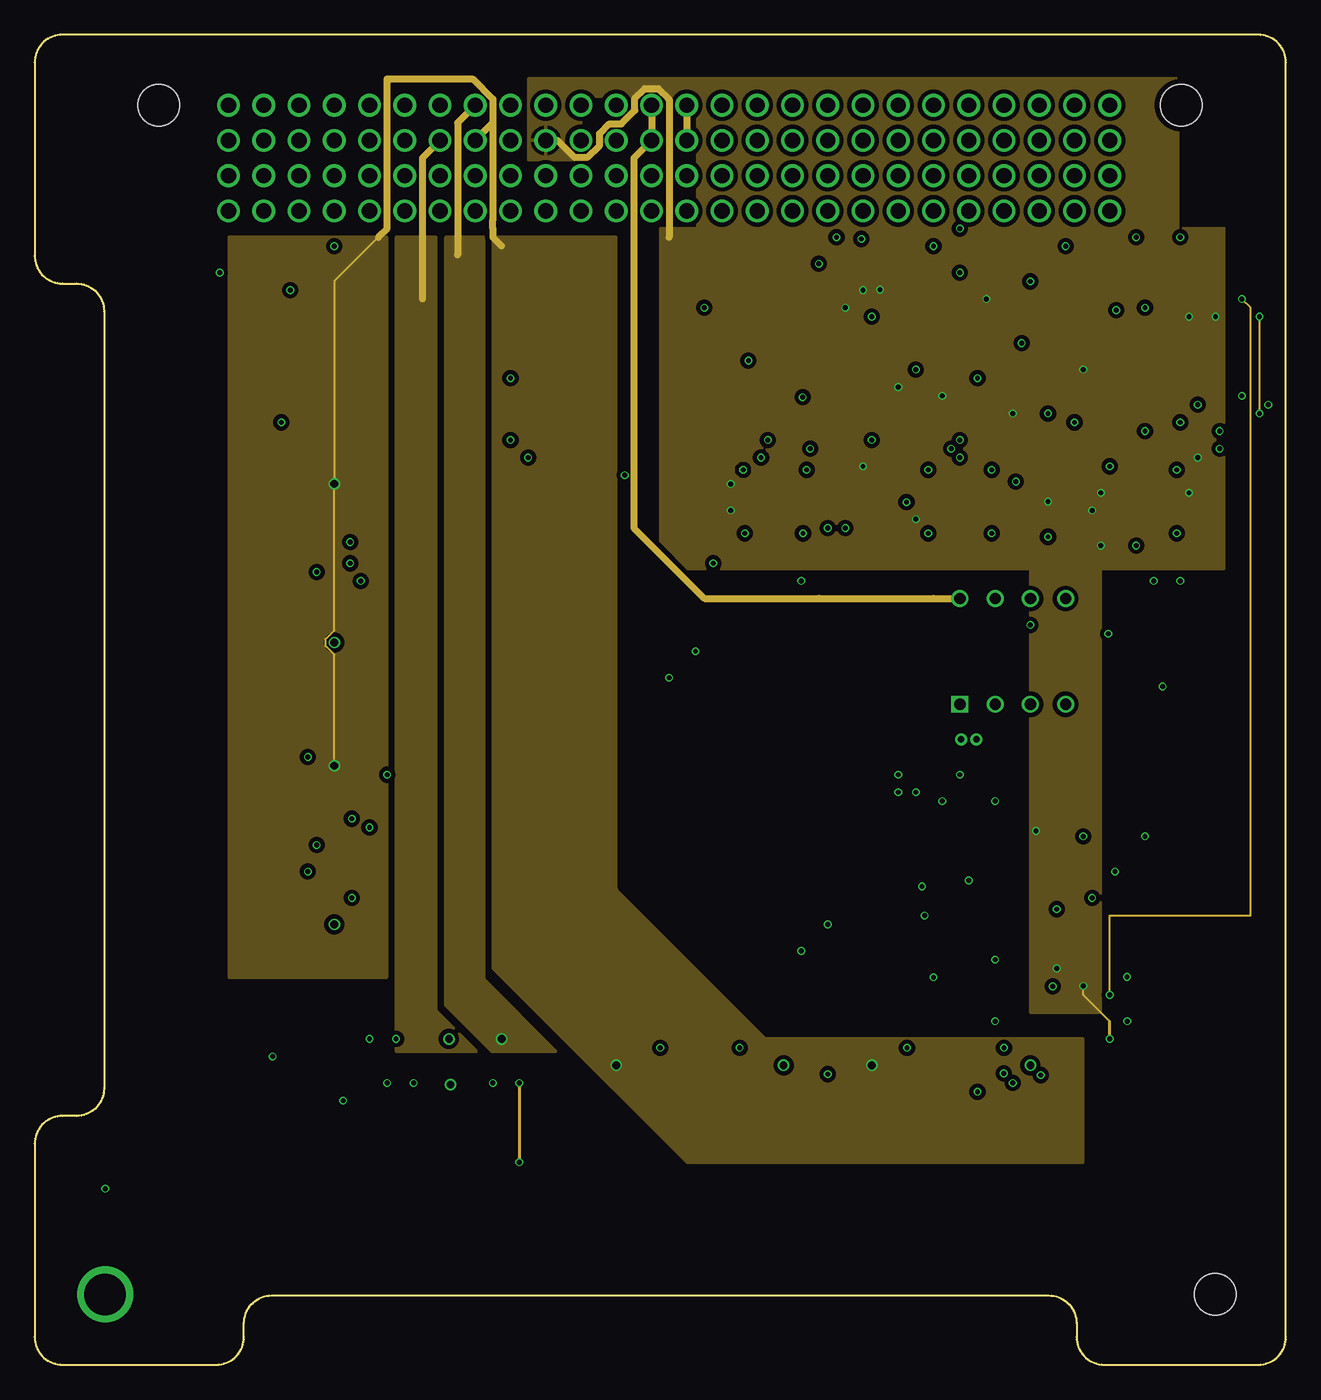
[diagram p8: board, inner layer Route15]
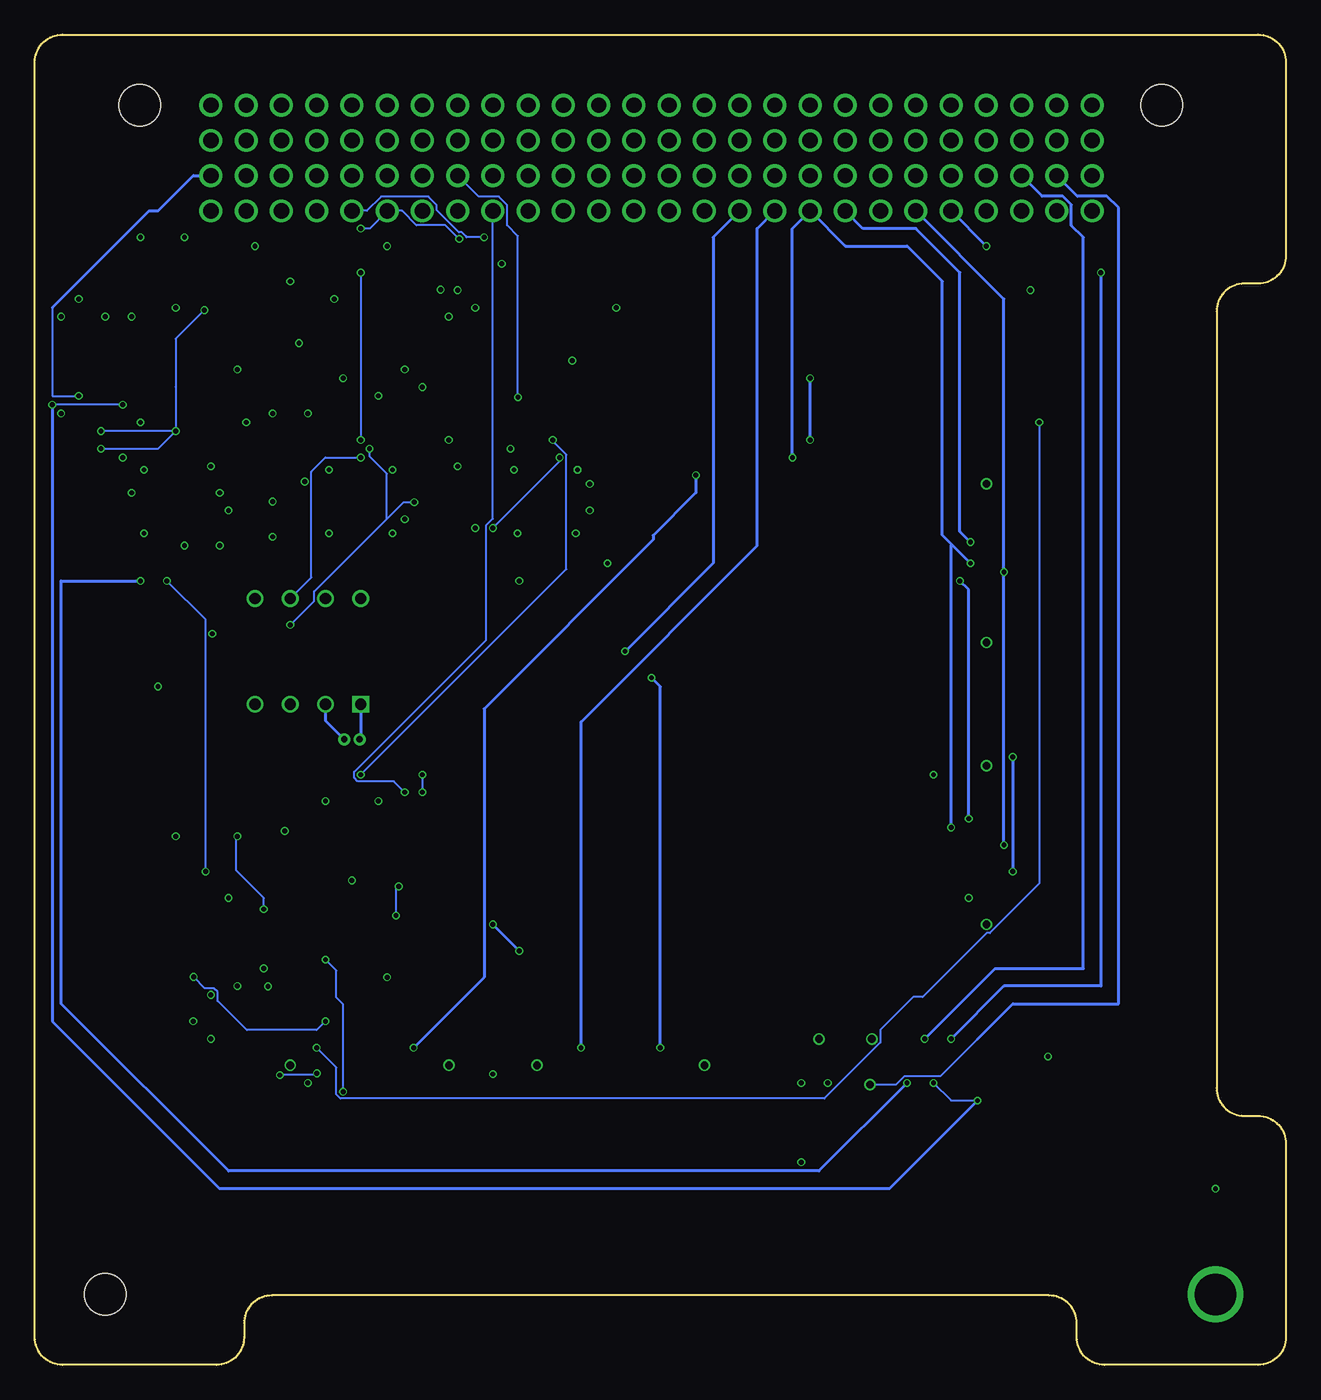
[diagram p9: board, bottom side, seen from below]

Size 90.17 x 95.89 mm. Coordinates in mm from the lower left corner, seen from the top.
Outline: 90.17,2 90.17,93.89 arc90 88.17,95.89 2,95.89 arc90 0,93.89 0,79.95 arc90 2,77.95 3,77.95 arc-90 5,75.95 5,19.94 arc-90 3,17.94 2,17.94 arc90 0,15.94 0,2 arc90 2,0 13.08,0 arc90 15.08,2 15.08,3 arc-90 17.08,5 73.08,5 arc-90 75.08,3 75.08,2 arc90 77.08,0 88.17,0 arc90 90.17,2
Copper layers (1*2*15*16): Top 0.035559375mm / dielectric 0.17018125mm / Route2 0.01778125mm / dielectric 47mil / Route15 0.01778125mm / dielectric 0.17018125mm / Bottom 0.035559375mm
Design rules "oshpark-4layer": minimum track width 5mil, minimum drill 10mil, track to track 5mil, track to pad 5mil, pad to pad 5mil, via to via 5mil, smd to smd 5mil, copper to edge 15mil, drill to drill 6mil, minimum pad ring 4mil, minimum via ring 4mil, stop-mask expansion 1.5mil, vias tented up to drill 0mil, thermal gap 10mil
Holes 3 mm at 8.95,90.81 82.61,90.81 85.09,5.08

### Footprints (pad centres in the part's own frame; a part is rotated, then mirrored left to right if it is on the bottom)
SOP65P640X120-16N = smd 1.57 x 0.41: 1 -2.87,2.275; 2 -2.87,1.625; 3 -2.87,0.975; 4 -2.87,0.325; 5 -2.87,-0.325; 6 -2.87,-0.975; 7 -2.87,-1.625; 8 -2.87,-2.275; 9 2.87,-2.275; 10 2.87,-1.625; 11 2.87,-0.975; 12 2.87,-0.325; 13 2.87,0.325; 14 2.87,0.975; 15 2.87,1.625; 16 2.87,2.275
BAT_BA2032SM = smd 2.6 x 3.56: + -14.65,0; - 14.65,0
CAPC3316X98N = smd 1.28 x 1.96: 1 -1.42,0; 2 1.42,0
CAPC0611X68N = smd 0.44 x 1.24: 1 -0.34,0; 2 0.34,0
CAPC3316X195N = smd 1.28 x 1.96: 1 -1.42,0; 2 1.42,0
CAPC2012X140N = smd 1.02 x 1.47: 1 -0.8,0; 2 0.8,0
CAPC3225X270N = smd 1.22 x 2.72: 1 -1.35,0; 2 1.35,0
SAMTEC_ESQ-126-39-G-D = drill 1.1: 1 0,0; 2 0,-2.54; 3 2.54,0; 4 2.54,-2.54; 5 5.08,0; 6 5.08,-2.54; 7 7.62,0; 8 7.62,-2.54; 9 10.16,0; 10 10.16,-2.54; 11 12.7,0; 12 12.7,-2.54; 13 15.24,0; 14 15.24,-2.54; 15 17.78,0; 16 17.78,-2.54; 17 20.32,0; 18 20.32,-2.54; 19 22.86,0; 20 22.86,-2.54; 21 25.4,0; 22 25.4,-2.54; 23 27.94,0; 24 27.94,-2.54; 25 30.48,0; 26 30.48,-2.54; 27 33.02,0; 28 33.02,-2.54; 29 35.56,0; 30 35.56,-2.54; 31 38.1,0; 32 38.1,-2.54; 33 40.64,0; 34 40.64,-2.54; 35 43.18,0; 36 43.18,-2.54; 37 45.72,0; 38 45.72,-2.54; 39 48.26,0; 40 48.26,-2.54; 41 50.8,0; 42 50.8,-2.54; 43 53.34,0; 44 53.34,-2.54; 45 55.88,0; 46 55.88,-2.54; 47 58.42,0; 48 58.42,-2.54; 49 60.96,0; 50 60.96,-2.54; 51 63.5,0; 52 63.5,-2.54
SOP65P640X120-14N = smd 1.475 x 0.45: 1 -2.938,1.95; 2 -2.938,1.3; 3 -2.938,0.65; 4 -2.938,0; 5 -2.938,-0.65; 6 -2.938,-1.3; 7 -2.938,-1.95; 8 2.938,-1.95; 9 2.938,-1.3; 10 2.938,-0.65; 11 2.938,0; 12 2.938,0.65; 13 2.938,1.3; 14 2.938,1.95
LGA-14 = smd 0.4 x 0.4: 1 -2,-1.1 | smd 0.6 x 1: 2 -1.2,-1.1; 3 -0.4,-1.1; 4 0.4,-1.1; 5 1.2,-1.1; 6 2,-1.1; 8 2,1.1; 9 1.2,1.1; 10 0.4,1.1; 11 -0.4,1.1; 12 -1.2,1.1; 13 -2,1.1 | smd 1 x 0.6: 7 2,0; 14 -2,0
SOT95P280X145-5N = smd 1.15 x 0.6: 1 -1.3,0.95; 2 -1.3,0; 3 -1.3,-0.95; 4 1.3,-0.95; 5 1.3,0.95
504050-0791 = smd 0.6 x 1: 1 4.5,0; 2 3,0; 3 1.5,0; 4 0,0; 5 -1.5,0; 6 -3,0; 7 -4.5,0 | smd 1.68 x 1.8: 8 -7.105,5.19; 9 7.105,5.19
FH2810S05SH05 = smd 0.3 x 1.3: 1 2.25,-3.6; 2 1.75,-3.6; 3 1.25,-3.6; 4 0.75,-3.6; 5 0.25,-3.6; 6 -0.25,-3.6; 7 -0.75,-3.6; 8 -1.25,-3.6; 9 -1.75,-3.6; 10 -2.25,-3.6 | smd 1.8 x 2.2: MP1 4.4,2.05; MP2 -4.4,2.05
504050-1091 = smd 0.6 x 1: 1 -13.5,0; 2 -12,0; 3 -10.5,0; 4 -9,0; 5 -7.5,0; 6 -6,0; 7 -4.5,0; 8 -3,0; 9 -1.5,0; 10 0,0 | smd 1.25 x 1.8: 11 2.605,5.19; 12 -16.105,5.19
DF13A2P125H21 = smd 0.7 x 1.8: 1 -0.625,-2.95; 2 0.625,-2.95 | smd 1.6 x 2.2: MP1 -2.975,0.35; MP2 2.975,0.35
RESC1106X84N = smd 0.85 x 0.7: 1 -0.55,0; 2 0.55,0
RESC1005X35N = smd 0.7 x 0.6: 1 -0.55,0; 2 0.55,0
RESC1608X55N = smd 0.9 x 0.95: 1 -0.8,0; 2 0.8,0
NXP_FXAS21002CQR1_0_EDITED = smd 0.8 x 0.3: 1 -2.029,1.5; 2 -2.029,1; 3 -2.029,0.5; 4 -2.029,0; 5 -2.029,-0.5; 6 -2.029,-1; 7 -2.029,-1.5; 13 2.029,-1.5; 14 2.029,-1; 15 2.029,-0.5; 16 2.029,0; 17 2.029,0.5; 18 2.029,1; 19 2.029,1.5 | smd 0.3 x 0.8: 8 -1,-2.029; 9 -0.5,-2.029; 10 0,-2.029; 11 0.5,-2.029; 12 1,-2.029; 20 1,2.029; 21 0.5,2.029; 22 0,2.029; 23 -0.5,2.029; 24 -1,2.029 | smd 2.489 x 2.489: 49 0,0
DIP762W47P254L991H457Q8 = drill 0.81 square: 1 -3.81,3.81 | drill 0.81: 2 -3.81,1.27; 3 -3.81,-1.27; 4 -3.81,-3.81; 5 3.81,-3.81; 6 3.81,-1.27; 7 3.81,1.27; 8 3.81,3.81
XTAL_ECS-.327-12.5-13X = drill 0.46 pad 0.86: 1 -0.55,0; 2 0.55,0

### Placement (x,y rotation side)
ADC  69.22,36.2 270 top
BT1  44.45,41.27 180 top
C1  48.26,60.96 270 top
C2  77.47,55.88 270 top
C3  76.2,30.48 270 top
C4  65.41,39.37 90 top
C5  53.34,58.42 0 top
C6  78.11,79.38 0 top
C7  60.33,73.03 135 top
C8  71.75,76.2 270 top
C10  74.93,64.77 90 top
C11  65.41,73.03 45 top
C12  50.8,74.3 0 top
C13  71.12,60.96 270 top
C14  82.55,67.31 180 top
C15  66.67,78.74 135 top
C16  62.23,65.41 90 top
C18  57.78,62.87 270 top
C19  78.11,59.05 180 top
C20  71.75,66.67 0 top
C21  57.15,66.04 0 top
C22  74.3,73.66 180 top
C23  67.94,73.66 270 top
C24  70.48,64.77 90 top
C25  56.52,76.83 90 top
C26  78.99,72.52 0 top
C27  54.61,73.03 180 top
C33  47.62,78.74 270 top
H1  13.97,85.72 0 top
H2  13.97,90.81 0 top
IC1  69.22,27.94 180 top
IC2  63.5,75.56 225 top
IC3  74.3,77.47 90 top
IC4  64.14,33.66 180 top
IC6  52.07,77.47 180 top
J1  21.59,57.78 90 top
J2  83.82,25.4 270 top
J3  21.59,37.47 90 top
J4  20.95,21.59 180 top
J5  48.01,21.59 180 top
J6  66.04,21.59 180 top
J7  11.43,20.32 90 top
J8  83.82,40.64 270 top
J9  13.97,71.12 90 top
J10  85.72,51.44 270 top
R10  64.77,36.83 90 top
R12  71.75,24.77 180 top
R14  72.39,31.75 270 top
R15  64.14,29.84 270 top
R19  67.94,24.13 315 top
R20  5.08,9.53 270 top
R31  61.59,79.38 270 top
R32  59.69,79.38 270 top
R33  59.69,69.85 0 top
R34  63.5,69.22 0 top
R35  85.72,73.66 90 top
R36  83.82,73.66 90 top
U1  53.34,62.23 180 top
U3  70.48,51.44 90 top
U4  80.01,62.23 180 top
U6  66.67,62.23 180 top
Y1  67.31,45.09 0 top

### Tracks (layer width: path | path; a pad name or v marks a point on that pad's centre or on a via)
3V3_BUS
  Route15 0.508: H2.27 H2.28
3V3_PDM9  (via drill 0.35)
  Top 0.152: IC1.4 72.38,28.16 72.97,28.16 73.39,28.57 v73.66,28.57 | IC4.5 64.66,34.53 64.66,34.99 67.22,37.55 | 67.22,37.55 67.74,38.08 68.5,38.08 68.89,38.47 ADC.5 69.13,38.82 69.13,38.23 69.28,38.08 71.75,38.08 v72.15,38.48 72.07,38.48 ADC.1 | v75.56,27.3 75.56,28.43 C3.2 | C5.1 50.16,58.42 | C18.1 57.49,64.58 C21.2 | C24.2 70.33,65.26 C20.1 70.33,68.43 v70.48,68.58 | U6.4 68.85,62.38 69.19,62.38 C13.1 72.88,62.38 v73.03,62.23 | C2.1 77.55,57.23 77.77,57.45 C19.2 v76.83,59.05 | U1.17 51.18,61.59 v50.16,61.59 | U6.17 U6.18 64.5,61.08 64.16,61.08 64.04,60.96 v63.5,60.96 | U4.17 77.85,61.59 v76.2,61.59 | U1.4 55.52,62.38 55.85,62.38 57.76,64.28 C18.1 | C18.1 59.2,64.28 v59.69,64.77 61.11,64.77 61.17,64.83 63.29,64.83 63.41,64.71 63.41,63.62 64.16,62.88 64.5,62.88 U6.15 | C26.1 76.5,73.66 C22.1 | C22.1 75.72,74.05 IC3.14 IC3.1 | C25.1 56.52,73.58 C27.1 | C25.1 54.46,77.47 IC6.14 IC6.1 | J2.1 J2.2 77.62,23.65 v77.47,23.5 | C25.1 57.3,76.2 v58.42,76.2 | v68.58,76.83 67.94,76.2 C23.1 | U4.15 76.97,62.73 v76.83,62.87 | C22.1 75.72,71.91 v75.56,71.75 | v68.58,76.83 C15.1 66.82,76.98 IC2.14 IC2.1 | v68.58,76.83 | R31.2 60.92,77.9 v60.92,77.51 | R32.2 v59.69,77.47 | R34.2 64.94,69.85 v65.41,69.85 | R33.2 61.12,70.48 v62.23,70.48 | R36.2 83.19,75.09 v83.19,75.56 | R35.2 85.09,75.09 v85.09,75.56 | U4.4 82.19,62.38 82.52,62.38 83.01,62.87 v83.19,62.87 | v83.82,65.41 83.97,65.56 C14.1 | U1.15 50.94,62.73 v50.16,63.5 | 67.22,37.55 66.88,37.55 C4.1 | IC2.1
  Top 0.203: U1.17 U1.18 50.16,61.23 | 50.16,61.23 v50.16,61.59 | 50.16,58.42 50.16,61.23 | U4.17 U4.18
  Route15 0.152: v75.56,27.3 75.56,26.67 77.47,24.77 | 45.66,91.31 45.72,91.24
  Route15 0.203: v77.47,23.5 77.47,24.77
  Route15 0.508: 45.66,91.31 44.95,92.01 43.95,92.01 43.24,91.31 43.24,90.43 42.28,89.47 41.41,89.47 40.7,88.77 40.7,87.89 39.87,87.06 38.87,87.06 37.66,88.27 H2.20 | 45.72,91.24 45.72,81.28
  pour Route15 (isolate 0.305): 45.09,57.4 85.72,57.4 85.72,81.92 45.09,81.92
  pour Route15 (isolate 0.305): 47.75,57.4 82.42,57.4 82.42,92.71 47.75,92.71
  pour Route15 (isolate 0.305): 71.75,25.4 76.83,25.4 76.83,57.78 71.75,57.78
  pour Route15 (isolate 0.305): 35.56,86.87 39.37,86.87 39.37,92.71 35.56,92.71
  pour Route15 (isolate 0.305): 35.56,91.44 80.52,91.44 80.52,92.71 35.56,92.71
5V_BUS
  Route15 0.508: U3.8 64.77,55.24 56.52,55.24 48.26,55.24 43.18,60.33 43.18,87 H2.26 H2.25
5V_PDM5
  Route15 0.508: H2.14 27.94,87 27.94,76.83
  pour Route15 (isolate 0.305): 26.04,22.61 31.88,22.61 29,25.48 28.97,25.51 28.96,25.55 28.96,81.28 26.04,81.28
5V_PDM6  (via drill 0.55)
  Top 0.152: J3.1 41.91,21.64 v41.91,21.59
  Top 0.508: J1.1 v21.59,63.5 | J3.1 v21.59,43.18 | J6.1 v60.33,21.59 | J5.1 v41.91,21.59
  Route15 0.152: 24.77,81.28 21.59,78.11 v21.59,63.5 21.59,52.94 20.97,52.33 20.97,51.81 21.59,51.2 v21.59,43.18
  Route15 0.508: 24.77,81.28 25.4,81.92 25.4,92.71 31.55,92.71 33.02,91.24 33.02,89.53 | 33.02,89.53 33.02,82.55 33.02,81.92 33.02,81.28 33.66,80.64 | 33.02,89.53 H2.16
  pour Route15 (isolate 0.305): 13.97,27.94 25.4,27.94 25.4,81.28 13.97,81.28
  pour Route15 (isolate 0.305): 52.73,23.5 52.69,23.51 41.93,34.27 41.91,34.31 41.91,81.28 33.02,81.28 33.02,28.57 46.99,14.61 75.56,14.61 75.56,23.5
5V_PDM7  (via drill 0.35, 0.55)
  Top 0.152: J4.8 24.92,20.62 24.92,20.12 30.44,14.61 v34.92,14.61
  Top 0.203: J4.1 34.45,20.79 v34.92,20.32
  Top 0.508: J4.1 34.45,22.7 v33.66,23.5
  Route15 0.203: v34.92,20.32 v34.92,14.61
  Route15 0.508: H2.15 30.48,89.53 30.48,80.01
  pour Route15 (isolate 0.305): 32.89,22.61 37.59,22.61 32.43,27.77 32.4,27.8 32.38,27.83 32.38,81.28 29.59,81.28 29.59,25.91
ADCIN0
  Top 0.152: IC1.1 72.29,26.13 | 72.29,26.13 72.38,26.21 73.61,26.21 74.36,26.97 74.36,33.33 ADC.16 | R12.1 72.31,26.12 72.29,26.13
ADCIN1
  Top 0.152: IC1.7 70.84,31.2 70.84,32.38 | 70.84,32.38 ADC.15 | R14.1 70.92,32.3 70.84,32.38
ADCIN2
  Top 0.152: ADC.14 69.95,33.08 69.95,32.49 68.53,31.07 66.82,31.07 66.28,30.52 IC1.8 64.64,29.89 R15.1
ADCIN3
  Top 0.152: ADC.13 69.3,33.08 69.3,32.49 68.51,31.7 64.3,31.7 63.43,30.83 63.43,28.24 65.45,26.21 66.06,26.21 IC1.14 67.56,24.71 R19.1
ADCIN4  (via drill 0.35)
  Top 0.152: ADC.12 68.89,32.7 68.18,31.98 66.44,31.98 65.72,32.7 IC4.1 64.45,32.7 v64.14,32.38 | R10.1 64.77,35.56 63.94,34.73 v63.94,34.49
  Bottom 0.152: v63.94,34.49 64.14,34.29 v64.14,32.38
CHASSIS  (via drill 0.35)
  Top 0.152: J2.3 80.37,24.3 80.95,24.3 81.07,24.42 81.07,32.34 v77.85,35.56 | v80.64,56.52 82.78,58.65 82.78,60.14 82.73,60.19 82.73,61.4 82.98,61.65 84.79,61.65 84.91,61.77 84.91,68.8 82.55,71.16 v82.55,81.28
  Route2 0.152: H2.49 76.44,89.29 77.9,89.29 82.55,84.64 v82.55,81.28
  Bottom 0.152: v77.85,35.56 77.85,53.72 v80.64,56.52
CHASSIS_CONNECTION  (via drill 3)
  Top 0.152: R20.2 v5.08,5.08
DTR  (via drill 0.35)
  Top 0.152: J4.5 27.47,22.57 26.95,22.57
  Top 0.203: 26.95,22.57 v26.04,23.5
  Bottom 0.203: v26.04,23.5 20.95,28.57 14.61,28.57 14.61,81.28 15.46,82.13 15.46,83.62 16.07,84.24 17.56,84.24 H1.5
GND  (via drill 0.35, 0.55)
  Top 0.152: J2.5 J2.4 78.86,24.65 v78.74,24.77 | v53.98,21.59 56.52,21.59 v57.15,20.95 | v51.05,64.52 51.05,64.45 51.12,64.45 | J6.7 70.54,20.38 v70.48,20.32 | IC2.11 IC2.10 63.58,74.5 63.37,74.71 62.64,74.71 IC2.7 62.09,73.17 v63.5,71.75 | U4.13 77.98,64.26 v77.47,64.77 | C25.2 v56.52,79.38 | C22.2 72.24,73.03 71.75,73.03 v71.12,73.66 | IC3.11 IC3.10 72.96,78.11 v71.75,78.11 | v48.26,76.2 48.26,76.69 C33.2 47.77,77.47 IC6.7 50.86,77.47 51.37,76.95 51.37,76.67 IC6.10 IC6.11 | C27.2 52.07,73.03 v51.44,72.39 | IC3.7 v74.3,80.64 | C6.2 79.38,79.53 v79.38,81.28 | C26.2 80.34,75.87 v80.01,76.2 | IC1.5 71.93,28.37 71.33,28.37 71.21,28.25 71.21,27.4 71.12,27.3 71.14,27.29 IC1.3 73.35,27.29 v73.36,27.28 | ADC.4 69.54,40.31 v69.22,40.64 | v64.77,27.94 65.42,27.29 IC1.12 IC1.11 IC1.10 | v67.31,34.92 66.99,34.6 IC4.3 IC4.2 | C3.1 v76.2,33.66 | J4.2 33.02,21.52 v33.02,20.32 | C7.2 59.32,74.56 v60.33,75.56 | C23.2 v67.94,71.12 | C15.2 v64.77,80.64 | v64.77,80.64 | C5.2 54.76,57 v55.24,56.52 | C18.2 58.42,60.81 v58.42,60.33 | C21.1 v55.88,66.04 | C16.2 62.08,66.67 v60.33,66.67 | C13.2 71.27,59.69 v73.03,59.69 | C24.1 70.71,64.2 v70.71,63.67 | C20.2 73.03,66.83 v73.03,68.58 | C10.2 v74.93,67.94 | C19.1 v79.38,59.05 | C2.2 77.47,52.8 v77.37,52.7 | v82.55,67.94 81.92,67.31 C14.2 | J7.2 15.66,22.23 v17.14,22.23 | J10.2 81.28,49.31 v81.28,48.9 | J8.2 80.01,39.16 v80.01,38.1 | J9.2 16.92,75.97 v18.41,77.47 | C1.2 48.9,58.91 v48.9,57.78 | C4.2 v65.41,40.64 | J3.7 22.28,33.66 v22.86,33.66 | BT1.- 26.67,41.27 v25.4,42.55
  Top 0.203: U1.14 U1.13 51.31,64.26 51.12,64.45 | U1.10 U1.9 U1.8 55.37,64.26 | U1.5 U1.6 U1.7 55.37,64.26 | U1.1 54.84,60.2 | 54.84,60.2 U1.24 U1.23 U1.22 U1.21 U1.20 51.84,60.2 | U1.19 51.84,60.2 | 54.84,60.2 55.12,60.2 v55.37,59.94 | 51.84,60.2 51.44,60.2 v51.18,59.94 | U6.14 U6.13 64.65,64.26 v64.39,64.52 | U6.10 U6.9 U6.8 68.7,64.26 | U6.5 U6.6 U6.7 68.7,64.26 | v68.96,64.52 68.7,64.26 | 55.37,64.26 v55.63,64.52 | U6.19 65.17,60.2 | 65.17,60.2 U6.20 U6.21 U6.22 U6.23 U6.24 68.17,60.2 | U6.1 68.17,60.2 | 65.17,60.2 64.65,60.2 v64.39,59.94 | 68.17,60.2 68.7,60.2 v68.96,59.94 | U4.14 U4.13 | U4.10 U4.9 U4.8 82.04,64.26 | U4.5 U4.6 U4.7 82.04,64.26 | 82.04,64.26 v82.3,64.52 | U4.1 81.51,60.2 | 81.51,60.2 U4.24 U4.23 U4.22 U4.21 U4.20 78.51,60.2 U4.19 | 81.51,60.2 82.04,60.2 v82.3,59.94
  Top 0.508: J1.7 v21.59,52.07 | J3.7 v21.59,31.75 | J5.7 v53.98,21.59 | v71.75,21.59 J6.7 | v5.08,12.7 R20.1
  pour Route2 (isolate 0.305): 0.64,1.27 89.53,1.27 89.53,95.25 0.64,95.25
I2C1_SCL  (via drill 0.35)
  Top 0.152: U6.11 66.17,64.91 v66.67,65.41 v66.67,66.67 | H1.44 66.52,82.39 66.48,82.39 66.19,82.11 66.19,81.72 67.32,80.59 67.32,79.38 v66.67,78.74 | R32.1 58.89,80.17 v57.78,81.28 57.5,81 53.98,81 53.27,80.29 IC6.2
  Bottom 0.152: U3.6 70.23,56.77 70.23,64.39 69.22,65.41 v66.67,65.41 | v66.67,78.74 v66.67,66.67 | v57.78,81.28 59.05,81.28 59.1,81.32 59.1,81.36 59.38,81.65 59.6,81.65 61.2,83.24 61.2,83.61 61.8,84.21 65.2,84.21 66.22,83.19 H1.44
I2C1_SDA  (via drill 0.35)
  Top 0.152: U6.12 65.67,65.67 v66.04,66.04 66.04,69.06 69.06,69.06 69.85,69.85 69.85,81.92 v66.67,81.92 | v71.75,53.34 72.39,53.34 U3.5 | IC6.3 52.47,79.89 52.46,79.91 52.45,79.91 52.33,80.03 52.33,81.8 58.94,81.8 v59.58,81.17 59.91,80.83 60.25,80.83 60.9,80.17 R31.1
  Bottom 0.152: v59.58,81.17 60.57,82.16 62.66,82.16 63.68,83.19 H1.42 66.04,81.92 v66.67,81.92 | v71.75,53.34 70.03,55.07 70.03,55.75 64.79,60.98 | v62.82,62.19 63.59,62.19 64.79,60.98 | 64.79,60.98 64.79,64.24 66.04,65.49 v66.04,66.04
I2C2_SCL  (via drill 0.35)
  Top 0.152: U1.11 v52.84,66.67 52.84,67.25 v55.34,69.75 55.92,69.17 61.02,69.17 61.07,69.22 R34.1 | v66.67,42.55 69.77,42.55 70.19,42.12 70.19,41.02 70.19,40.64 ADC.3 | H1.37 59.69,84.64 61.2,83.13 61.2,82.76 62.94,81.03 62.94,77.83 IC2.2
  Bottom 0.152: v55.34,69.75 55.34,81.38 56.12,82.16 56.12,83.61 56.72,84.21 58.18,84.21 H1.37 | v66.67,42.55 51.86,57.36 51.86,65.6 51.87,65.61 52.84,66.58 v52.84,66.67
I2C2_SDA  (via drill 0.35)
  Top 0.152: v57.15,60.33 69.04,48.44 72.09,48.44 72.57,47.96 72.57,45.22 70.84,43.5 ADC.2 | 57.68,72.49 56.65,71.46 56.37,71.46 52.34,67.43 v52.34,65.41 U1.12 | 57.68,72.49 58.14,72.95 58.14,73.53 57.97,73.7 57.97,73.89 61.84,77.76 61.87,77.76 62.27,77.36 | H1.35 57.15,84.64 58.18,83.61 58.18,83.24 60.31,81.11 61.88,81.11 62.27,80.71 62.27,77.36 | R33.1 58.89,71.28 57.68,72.49 | IC2.3 62.27,77.36
  Bottom 0.152: v57.15,60.33 52.34,65.14 v52.34,65.41
I2C3_SCL  (via drill 0.35)
  Top 0.152: U4.11 79.51,66.81 v80.01,67.31 | v27.3,20.32 26.95,20.67 J4.6 | 83.19,57.15 85.39,59.36 v85.39,66.04 | v85.39,67.31 85.39,68.25 v87,69.85 86.83,69.85 R36.1 | IC3.2 75.47,76.2 76.47,76.2 76.73,75.94 76.85,75.82 77.52,75.82 77.73,76.04 v77.94,76.04
  Top 0.203: v82.55,56.52 83.19,57.15
  Bottom 0.152: 88.9,76.2 88.9,69.85 v87,69.85 | v77.94,76.04 80.01,73.97 80.01,70.48 v80.01,67.31 | v85.39,66.04 81.28,66.04 v80.01,67.31 | v80.01,67.31 v85.39,67.31
  Bottom 0.2: 88.9,76.2 81.92,83.19 81.28,83.19 78.74,85.72 H1.51
  Bottom 0.203: v27.3,20.32 33.66,13.97 76.2,13.97 88.27,26.04 88.27,56.52 v82.55,56.52
I2C3_SDA  (via drill 0.35)
  Top 0.152: U4.12 79.01,68.85 79.38,69.22 | J4.7 25.45,20.38 v25.4,20.32 | H1.49 76.2,84.45 82.55,84.45 88.9,78.11 88.9,72.39 | 88.9,72.39 v88.9,69.22 | 79.38,69.22 79.38,76.88 78.3,77.95 76.95,77.95 76.73,77.73 76.73,77.72 76.48,77.47 76.08,77.47 75.98,77.37 75.69,77.37 IC3.3 | 79.38,69.22 v83.82,69.22 | R35.1 86.19,72.39 88.9,72.39
  Bottom 0.152: v25.4,20.32 24.13,19.05 v22.23,19.05 | v83.82,69.22 v88.9,69.22
  Bottom 0.203: v22.23,19.05 28.57,12.7 76.83,12.7 88.9,24.77 v88.9,69.22
N$8
  Top 0.152: IC3.6 76.59,79.47 C6.1
N$9
  Top 0.152: IC3.12 72.48,76.27 C8.1
N$10
  Top 0.152: IC3.13 71.83,75.47 C8.2
N$11
  Top 0.152: IC2.12 65.13,75.22 65.33,75.01 65.33,74.28 64.89,73.83 64.89,72.51 C11.1
N$12
  Top 0.152: IC2.13 65.97,75.92 C11.2
N$13
  Top 0.152: IC2.6 61.31,72.04 C7.1
N$14
  Top 0.152: C12.1 51.27,75.56 53.34,75.56 53.34,76.3 IC6.12
N$15
  Top 0.152: C12.2 52.23,74.93 53.98,74.93 54.07,75.03 IC6.13
N$16
  Top 0.152: IC6.6 48.48,80.16 C33.1
N$30
  Bottom 0.203: U3.2 69.22,46.44 Y1.2
N$41
  Bottom 0.203: U3.1 66.67,45.17 Y1.1
N$44
  Top 0.152: U3.3 69.75,45.62 69.65,45.62 69.53,45.5 69.53,44.77 68.58,43.81 66.67,43.81 66.04,43.18 66.04,41.91 59.73,41.91 BT1.+
N$67
  Top 0.152: U4.16 76.05,62.23 C10.1
N$71
  Top 0.152: 49.53,62.23 48.41,62.23 C1.1
  Top 0.203: U1.16 49.53,62.23
N$72
  Top 0.152: C16.1 63.02,63.2 63.02,62.67 63.46,62.23 U6.16
PH1_POS  (via drill 0.35)
  Top 0.152: IC1.2 71.93,26.42 70.87,26.42 v69.22,24.77 R12.2 | J8.1 80.17,40.57 79.89,40.57 77.37,38.05 77.37,33.16 79.86,30.68 79.86,30.28 78.72,29.14 v78.72,27.96
  Bottom 0.152: v69.22,24.77 69.85,24.13 74.89,24.13 76.99,26.23 76.99,26.87 77.27,27.15 77.91,27.15 v78.72,27.96
PH2_POS  (via drill 0.35)
  Top 0.152: IC1.6 72.38,29.46 72.97,29.46 73.09,29.58 | 73.09,29.58 73.66,30.15 v73.66,32.84 | R14.2 73.09,30.5 73.09,29.58 | J10.1 82.08,51.36 81.79,51.36 75.56,45.14 v75.56,38.1
  Bottom 0.152: v73.66,32.84 73.66,33.66 75.67,35.66 75.67,38 v75.56,38.1
PH3_POS  (via drill 0.35)
  Top 0.152: v69.22,29.21 69.19,29.24 IC1.9 64.19,29.24 R15.2 | J7.1 16.87,19.7 19.42,17.15 19.42,11.21 19.54,11.09 21.1,11.09 21.3,11.29 31.4,11.29 31.6,11.09 33.17,11.09 35.41,13.33 35.41,16.56 38.53,19.68 v67.94,19.68
  Bottom 0.152: v67.94,19.68 67.94,25.99 68.42,26.47 68.42,28.42 v69.22,29.21
PH4_POS  (via drill 0.35)
  Top 0.152: J9.1 16.92,68.81 v17.78,67.94 | v69.85,22.86 69.22,22.86 R19.2 68.33,26.28 67.97,26.64 IC1.13
  Bottom 0.152: v17.78,67.94 17.78,34.69 21.34,31.13 21.57,31.13 26.19,26.52 26.87,26.52 29.23,24.15 29.23,23.24 33.26,19.2 68.14,19.2 68.42,19.49 68.42,21.43 v69.85,22.86
PH5_POS  (via drill 0.35)
  Top 0.152: 63.5,37.47 63.5,35.27 IC4.4 | 63.5,37.47 v63.5,41.27 | R10.2 63.59,37.38 63.5,37.47
  Bottom 0.152: H1.36 57.15,61 57.63,60.52 57.63,52.27 67.16,42.74 67.16,42.35 66.87,42.06 64.29,42.06 v63.5,41.27
SPI_EN_1
  Top 0.203: J1.2 22.68,60.78 22.86,60.96 22.86,84.45 H1.7
SPI_EN_2
  Top 0.203: J3.2 19.05,43.01 19.05,79.38 21.59,81.92 H1.8
SPI_EN_3  (via drill 0.35)
  Top 0.203: J5.2 45.01,22.78 v45.09,22.86 | v45.72,49.53 v47.62,51.44
  Bottom 0.203: v45.09,22.86 45.09,48.9 v45.72,49.53 | v47.62,51.44 41.27,57.78 41.27,81.28 H1.22
SPI_EN_4  (via drill 0.35)
  Top 0.203: v62.87,22.86 63.04,22.68 J6.2 | H1.21 39.37,84.67 38.32,83.62 38.32,68.34 v42.52,64.14
  Bottom 0.203: v42.52,64.14 42.52,62.87 45.6,59.79 45.6,59.48 57.78,47.29 57.78,27.94 v62.87,22.86
SPI_MISO  (via drill 0.35)
  Top 0.203: J1.4 v22.73,57.78 | J3.4 22.86,37.47 v24.13,38.73 | J6.4 57.15,30.48 v57.15,31.75 56.52,32.38 56.52,47.62 49.53,54.61 47.62,54.61 36.83,65.41 v35.56,65.41 | J5.4 55.24,28.83 v55.24,29.84
  Bottom 0.203: v22.73,57.78 24.07,59.12 | 24.07,59.12 24.77,59.82 24.77,78.11 27.3,80.64 31.75,80.64 H1.18 35.56,81.92 v35.56,65.41 | v24.13,38.73 24.13,59.05 24.07,59.12 | v55.24,29.84 v57.15,31.75
SPI_MOSI  (via drill 0.35)
  Top 0.152: 34.29,64.77 36.83,64.77 45.72,55.88 45.72,53.34
  Top 0.203: J1.3 22.71,59.28 | 22.71,59.28 v22.73,59.31 | J3.3 22.45,38.97 v22.86,39.37 | v23.5,56.52 23.5,58.5 22.71,59.28 | J6.3 64.54,22.07 55.88,30.73 | 55.88,30.73 55.88,45.72 48.26,53.34 45.72,53.34 | v34.29,66.67 34.29,64.77 | v34.29,71.12 34.29,80.64 33.02,81.92 33.02,82.55 32.38,83.19 H1.16 | J5.3 46.51,23.01 54.23,30.73 55.88,30.73
  Bottom 0.203: v22.73,59.31 23.5,60.07 23.5,78.74 26.67,81.92 30.48,81.92 H1.16 | v22.86,39.37 22.86,55.88 v23.5,56.52 | v34.29,66.67 v34.29,71.12
SPI_SCK  (via drill 0.35)
  Top 0.152: 57.78,31.34 57.78,38.59 57.6,38.78 57.6,38.92 57.15,39.37 57.15,43.81 57.78,44.45 57.78,48.26
  Top 0.203: J1.5 21.18,56.28 v20.32,57.15 | J3.5 20.32,37.23 v20.32,37.47 | 57.78,31.34 J6.5 67.54,21.18 66.67,20.32 50.78,20.32 J5.5 | 57.78,48.26 50.8,55.24 47.62,55.24 27.94,74.93 27.94,81.92 H1.12
  Bottom 0.203: v20.32,37.47 v20.32,57.15 20.32,76.83 H1.12
SPI_SS_1
  Top 0.203: J1.6 23.67,54.78 24.13,55.24 24.13,81.69 25.18,82.75 25.18,83.62 24.13,84.67 H1.9
SPI_SS_2  (via drill 0.35)
  Top 0.203: v19.68,43.81 19.68,78.74 v21.59,80.64 | v19.68,35.56 20.78,34.47 J3.6
  Bottom 0.203: v19.68,43.81 v19.68,35.56 | v21.59,80.64 H1.10
SPI_SS_3  (via drill 0.35)
  Top 0.203: J5.6 51.01,22.65 v50.8,22.86
  Bottom 0.203: v50.8,22.86 50.8,46.35 38.1,59.05 38.1,81.92 H1.20
SPI_SS_4  (via drill 0.35)
  Top 0.152: 62.23,44.45 v62.23,42.55 | v62.23,41.27 61.59,40.64 61.59,29.04
  Top 0.203: J6.6 61.59,29.04 | 62.23,44.45 50.8,55.88 47.62,55.88 35.78,67.73 35.78,83.62 36.83,84.67 H1.19
  Bottom 0.152: v62.23,42.55 v62.23,41.27
UART3_RX  (via drill 0.35)
  Top 0.152: v72.5,20.89 72.67,21.05 83.63,21.05 87.35,24.77 87.63,24.77 | J2.7 78.31,26.15 78.24,26.08 77.11,26.08 70.14,19.11 70.14,19.43 69.84,19.74 v69.84,21.01 | 88.27,25.4 88.43,25.57 88.43,68.42 v88.27,68.58 | v88.27,75.56 88.27,78.11
  Top 0.203: 88.27,25.4 87.63,24.77
  Top 0.254: H1.52 83.19,83.19 88.27,78.11
  Route15 0.152: v88.27,68.58 v88.27,75.56
  Bottom 0.152: v69.84,21.01 69.96,20.89 v72.5,20.89
UART3_TX  (via drill 0.35)
  Top 0.152: v77.47,26.67 80.2,26.67 J2.8 | H1.50 76.02,83.19 77.04,82.16 82.94,82.16 87,78.11 v87,76.83
  Route15 0.152: v77.47,26.67 77.47,32.38 87.63,32.38 87.63,76.2 v87,76.83
UART8_RX  (via drill 0.55)
  Top 0.508: J4.4 29.95,20.21 v29.97,20.19
  Bottom 0.152: 22.23,23.5 24.92,20.8 27.5,20.8 28.11,20.19 v29.97,20.19
  Bottom 0.203: 22.23,23.5 19.68,26.04 12.06,26.04 12.06,83.41 12.9,84.24 15.02,84.24 H1.3
UART8_TX  (via drill 0.35, 0.55)
  Top 0.152: v29.84,23.5 26.71,23.5 26.23,23.98 25.84,23.98 25.36,23.5 v24.13,23.5
  Top 0.203: H1.1 12.7,85.72 11.43,84.45 11.43,82.55 13.34,80.64 v13.34,78.74
  Top 0.508: J4.3 31.45,21.89 v29.84,23.5
  Bottom 0.203: v24.13,23.5 20.32,27.3 13.34,27.3 v13.34,78.74